# Altium project backplane.PRJPCB
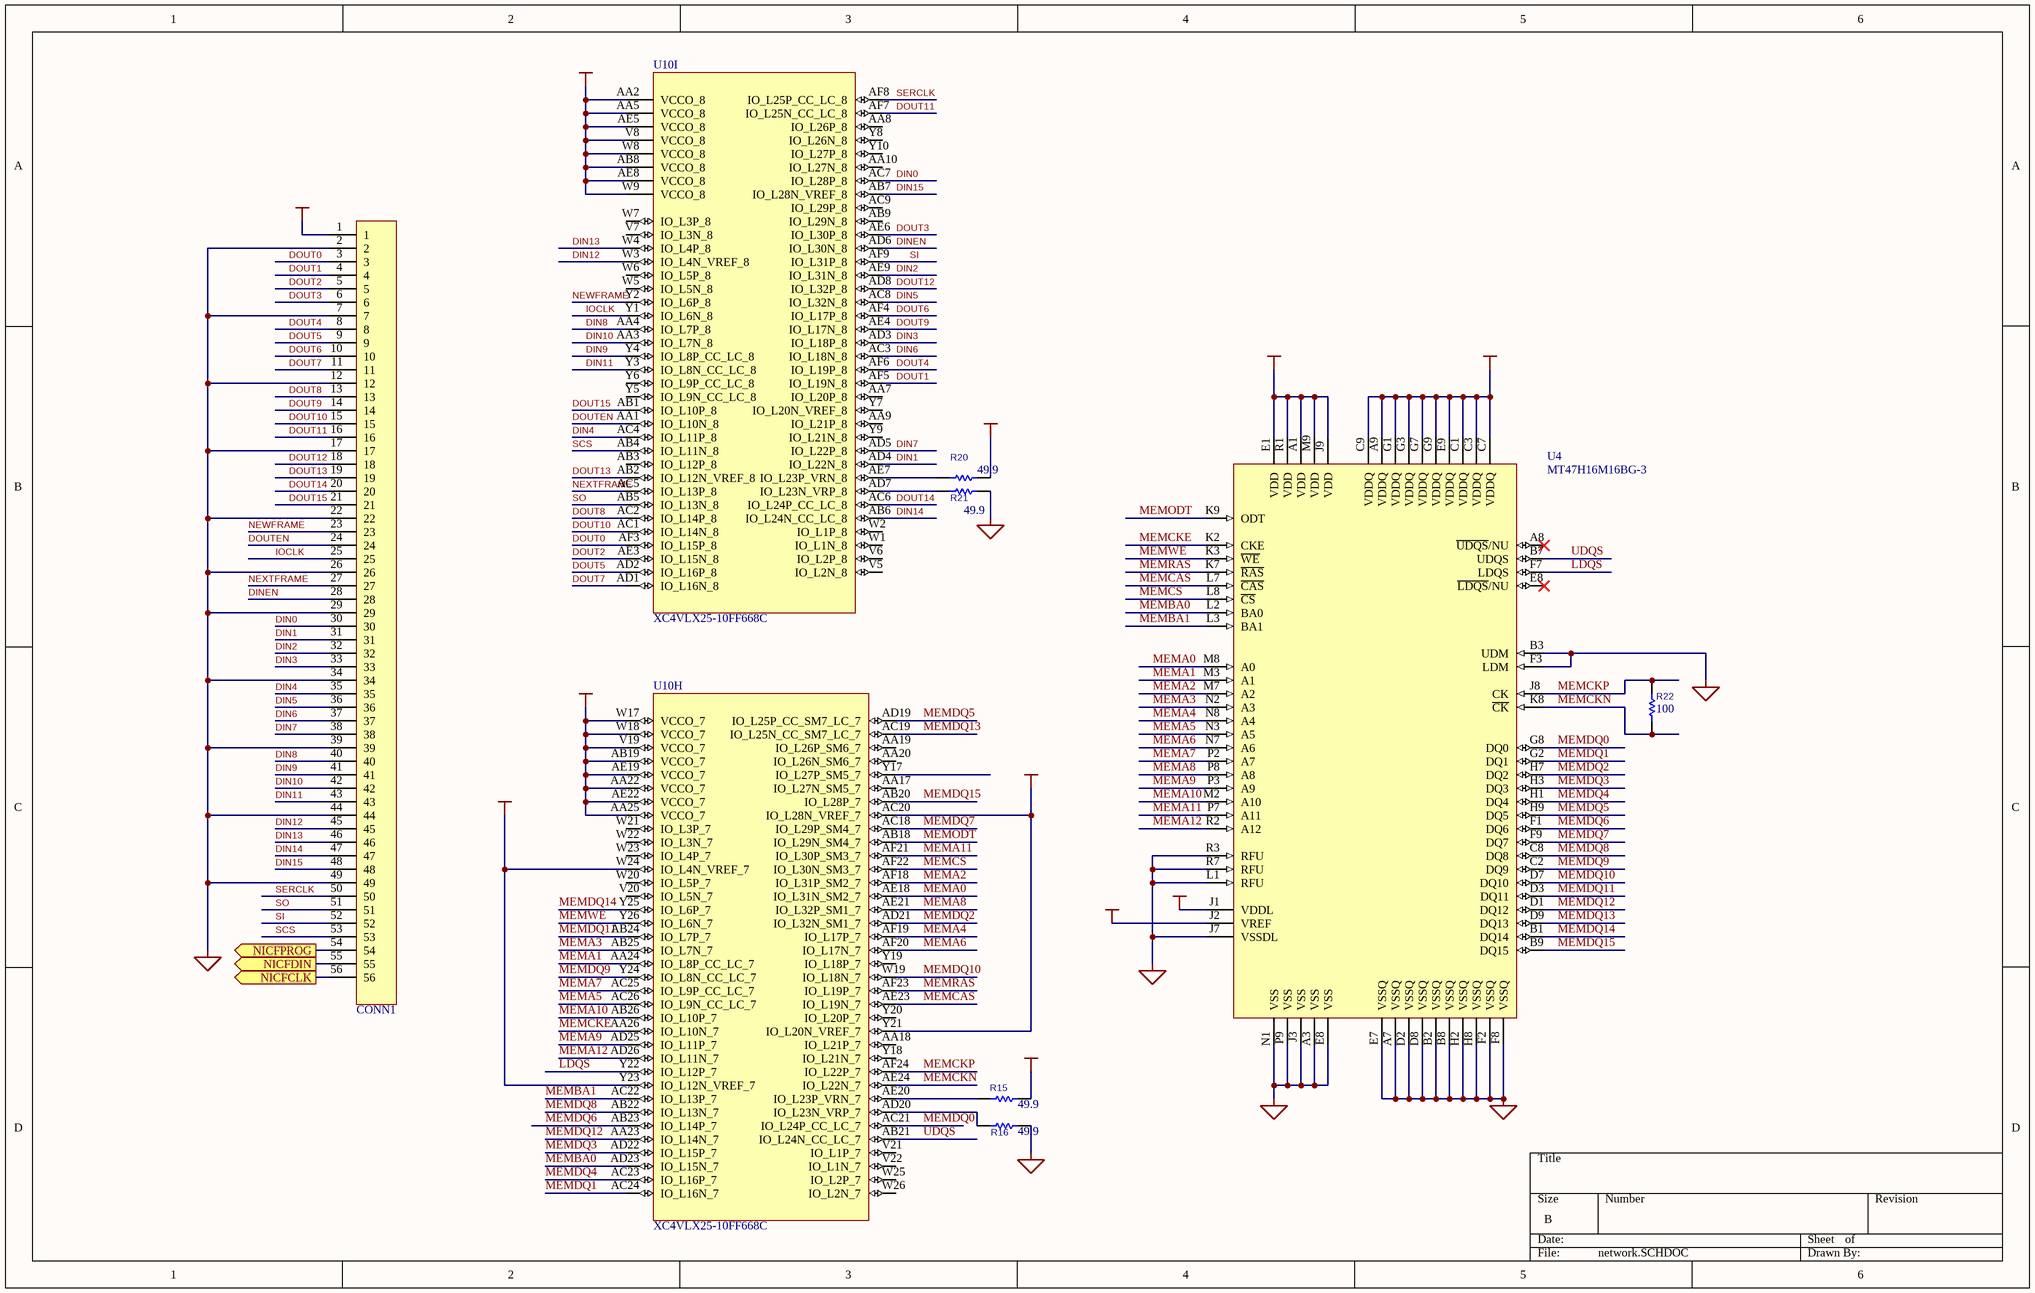
[diagram p0: network.SCHDOC]
8 sheets, 200 parts. Net scope: flat (ports and power ports of the same name join across sheets).
Board file: backplane.PCBDOC
Sheets:
  network.SCHDOC
  peripheralconn.SCHDOC
  DSPCONN.12-15.SCHDOC
  power and clocks.SCHDOC
  DSPCONN.8-11.SCHDOC
  DSPCONN.4-7.SCHDOC
  DSPCONN.0-3.SCHDOC
  fpga.SCHDOC

## Sheet network.SCHDOC
size B

### Parts
CONN1  CON56B  [HDR56]  (value not drawn)
R15  value 49.9  [0402]  (hidden comment: 50)
R16  value 49.9  [0402]  (hidden comment: 50)
R20  value 49.9  [0402]  (hidden comment: 50)
R21  value 49.9  [0402]  (hidden comment: 50)
R22  value 100  [0402]  (hidden comment: 50)
U4  MT47H16M16BG-3  [MICRON84FBGA]
U10  XC4VLX25-10FF668C  [Xilinx FF668]  (parts H,I of 13)

### Ports
NICFCLK (out), NICFDIN (out), NICFPROG (out)

### Nets
3.3VCC: R20.1
+0.9VCC: U4.J2(VREF) U10.AC20(IO_L28N_VREF_7) U10.W24(IO_L4N_VREF_7) U10.Y21(IO_L20N_VREF_7) U10.Y23(IO_L12N_VREF_7)
+1.8VCC: R15.1 U4.A1(VDD) U4.A9(VDDQ) U4.C1(VDDQ) U4.C3(VDDQ) U4.C7(VDDQ) U4.C9(VDDQ) U4.E1(VDD) U4.E9(VDDQ) U4.G1(VDDQ) U4.G3(VDDQ) U4.G7(VDDQ) U4.G9(VDDQ) U4.J1(VDDL) U4.J9(VDD) U4.M9(VDD) U4.R1(VDD) U10.AA22(VCCO_7) U10.AA25(VCCO_7) U10.AB19(VCCO_7) U10.AE19(VCCO_7) U10.AE22(VCCO_7) U10.V19(VCCO_7) U10.W17(VCCO_7) U10.W18(VCCO_7)
GND: CONN1.2 CONN1.7 CONN1.12 CONN1.17 CONN1.22 CONN1.26 CONN1.29 CONN1.34 CONN1.39 CONN1.44 CONN1.49 R16.1 R21.1 U4.A3(VSS) U4.A7(VSSQ) U4.B2(VSSQ) U4.B3(UDM) U4.B8(VSSQ) U4.D2(VSSQ) U4.D8(VSSQ) U4.E7(VSSQ) U4.E8(VSS) U4.F2(VSSQ) U4.F3(LDM) U4.F8(VSSQ) U4.H2(VSSQ) U4.H8(VSSQ) U4.J3(VSS) U4.J7(VSSDL) U4.L1(RFU) U4.N1(VSS) U4.P9(VSS) U4.R3(RFU) U4.R7(RFU)
VCC: CONN1.1 U10.AA2(VCCO_8) U10.AA5(VCCO_8) U10.AB8(VCCO_8) U10.AE5(VCCO_8) U10.AE8(VCCO_8) U10.V8(VCCO_8) U10.W8(VCCO_8) U10.W9(VCCO_8)
DIN0: CONN1.30 U10.AC7(IO_L28P_8)
DIN1: CONN1.31 U10.AD4(IO_L22N_8)
DIN2: CONN1.32 U10.AE9(IO_L31N_8)
DIN3: CONN1.33 U10.AD3(IO_L18P_8)
DIN4: CONN1.35 U10.AC4(IO_L11P_8)
DIN5: CONN1.36 U10.AC8(IO_L32N_8)
DIN6: CONN1.37 U10.AC3(IO_L18N_8)
DIN7: CONN1.38 U10.AD5(IO_L22P_8)
DIN8: CONN1.40 U10.AA4(IO_L7P_8)
DIN9: CONN1.41 U10.Y4(IO_L8P_CC_LC_8)
DIN10: CONN1.42 U10.AA3(IO_L7N_8)
DIN11: CONN1.43 U10.Y3(IO_L8N_CC_LC_8)
DIN12: CONN1.45 U10.W3(IO_L4N_VREF_8)
DIN13: CONN1.46 U10.W4(IO_L4P_8)
DIN14: CONN1.47 U10.AB6(IO_L24N_CC_LC_8)
DIN15: CONN1.48 U10.AB7(IO_L28N_VREF_8)
DINEN: CONN1.28 U10.AD6(IO_L30N_8)
DOUT0: CONN1.3 U10.AF3(IO_L15P_8)
DOUT1: CONN1.4 U10.AF5(IO_L19N_8)
DOUT2: CONN1.5 U10.AE3(IO_L15N_8)
DOUT3: CONN1.6 U10.AE6(IO_L30P_8)
DOUT4: CONN1.8 U10.AF6(IO_L19P_8)
DOUT5: CONN1.9 U10.AD2(IO_L16P_8)
DOUT6: CONN1.10 U10.AF4(IO_L17P_8)
DOUT7: CONN1.11 U10.AD1(IO_L16N_8)
DOUT8: CONN1.13 U10.AC2(IO_L14P_8)
DOUT9: CONN1.14 U10.AE4(IO_L17N_8)
DOUT10: CONN1.15 U10.AC1(IO_L14N_8)
DOUT11: CONN1.16 U10.AF7(IO_L25N_CC_LC_8)
DOUT12: CONN1.18 U10.AD8(IO_L32P_8)
DOUT13: CONN1.19 U10.AB2(IO_L12N_VREF_8)
DOUT14: CONN1.20 U10.AC6(IO_L24P_CC_LC_8)
DOUT15: CONN1.21 U10.AB1(IO_L10P_8)
DOUTEN: CONN1.24 U10.AA1(IO_L10N_8)
IOCLK: CONN1.25 U10.Y1(IO_L6N_8)
LDQS: U4.F7(LDQS) U10.Y22(IO_L12P_7)
MEMA0: U4.M8(A0) U10.AE18(IO_L31N_SM2_7)
MEMA1: U4.M3(A1) U10.AA24(IO_L8P_CC_LC_7)
MEMA2: U4.M7(A2) U10.AF18(IO_L31P_SM2_7)
MEMA3: U4.N2(A3) U10.AB25(IO_L7N_7)
MEMA4: U4.N8(A4) U10.AF19(IO_L17P_7)
MEMA5: U4.N3(A5) U10.AC26(IO_L9N_CC_LC_7)
MEMA6: U4.N7(A6) U10.AF20(IO_L17N_7)
MEMA7: U4.P2(A7) U10.AC25(IO_L9P_CC_LC_7)
MEMA8: U4.P8(A8) U10.AE21(IO_L32P_SM1_7)
MEMA9: U4.P3(A9) U10.AD25(IO_L11P_7)
MEMA10: U4.M2(A10) U10.AB26(IO_L10P_7)
MEMA11: U4.P7(A11) U10.AF21(IO_L30P_SM3_7)
MEMA12: U4.R2(A12) U10.AD26(IO_L11N_7)
MEMBA0: U4.L2(BA0) U10.AD23(IO_L15N_7)
MEMBA1: U4.L3(BA1) U10.AC22(IO_L13P_7)
MEM~{CAS}: U4.L7(~{CAS}) U10.AE23(IO_L19N_7)
MEM~{CS}: U4.L8(~{CS}) U10.AF22(IO_L30N_SM3_7)
MEMCKE: U4.K2(CKE) U10.AA26(IO_L10N_7)
MEMCKN: R22.2 U4.K8(~{CK}) U10.AE24(IO_L22N_7)
MEMCKP: R22.1 U4.J8(CK) U10.AF24(IO_L22P_7)
MEMDQ0: U4.G8(DQ0) U10.AC21(IO_L24P_CC_LC_7)
MEMDQ1: U4.G2(DQ1) U10.AC24(IO_L16N_7)
MEMDQ2: U4.H7(DQ2) U10.AD21(IO_L32N_SM1_7)
MEMDQ3: U4.H3(DQ3) U10.AD22(IO_L15P_7)
MEMDQ4: U4.H1(DQ4) U10.AC23(IO_L16P_7)
MEMDQ5: U4.H9(DQ5) U10.AD19(IO_L25P_CC_SM7_LC_7)
MEMDQ6: U4.F1(DQ6) U10.AB23(IO_L14P_7)
MEMDQ7: U4.F9(DQ7) U10.AC18(IO_L29P_SM4_7)
MEMDQ8: U4.C8(DQ8) U10.AB22(IO_L13N_7)
MEMDQ9: U4.C2(DQ9) U10.Y24(IO_L8N_CC_LC_7)
MEMDQ10: U4.D7(DQ10) U10.W19(IO_L18N_7)
MEMDQ11: U4.D3(DQ11) U10.AB24(IO_L7P_7)
MEMDQ12: U4.D1(DQ12) U10.AA23(IO_L14N_7)
MEMDQ13: U4.D9(DQ13) U10.AC19(IO_L25N_CC_SM7_LC_7)
MEMDQ14: U4.B1(DQ14) U10.Y25(IO_L6P_7)
MEMDQ15: U4.B9(DQ15) U10.AB20(IO_L28P_7)
MEMODT: U4.K9(ODT) U10.AB18(IO_L29N_SM4_7)
MEM~{RAS}: U4.K7(~{RAS}) U10.AF23(IO_L19P_7)
MEM~{WE}: U4.K3(~{WE}) U10.Y26(IO_L6N_7)
NEWFRAME: CONN1.23 U10.Y2(IO_L6P_8)
NEXTFRAME: CONN1.27 U10.AC5(IO_L13P_8)
SCS: CONN1.53 U10.AB4(IO_L11N_8)
SERCLK: CONN1.50 U10.AF8(IO_L25P_CC_LC_8)
SI: CONN1.52 U10.AF9(IO_L31P_8)
SO: CONN1.51 U10.AB5(IO_L13N_8)
UDQS: U4.B7(UDQS) U10.AB21(IO_L24N_CC_LC_7)
NetCONN1_54: CONN1.54 ; port NICFPROG
NetCONN1_55: CONN1.55 ; port NICFDIN
NetCONN1_56: CONN1.56 ; port NICFCLK
NetR15_2: R15.2 U10.AE20(IO_L23P_VRN_7)
NetR16_2: R16.2 U10.AD20(IO_L23N_VRP_7)
NetR20_2: R20.2 U10.AE7(IO_L23P_VRN_8)
NetR21_2: R21.2 U10.AD7(IO_L23N_VRP_8)

Not connected (* = marked no-connect by the designer): U4 A8(~{UDQS}/NU)*; U10 AA7(IO_L20P_8) AA8(IO_L26P_8) AA9(IO_L21P_8) AA10(IO_L27N_8) AA17(IO_L27N_SM5_7) AA18(IO_L21P_7) AA19(IO_L26P_SM6_7) AA20(IO_L26N_SM6_7) AB3(IO_L12P_8) AB9(IO_L29N_8) AC9(IO_L29P_8) V5(IO_L2N_8) V6(IO_L2P_8) V7(IO_L3N_8) V20(IO_L5N_7) V21(IO_L1P_7) V22(IO_L1N_7) W1(IO_L1N_8) W2(IO_L1P_8) W5(IO_L5N_8) W6(IO_L5P_8) W7(IO_L3P_8) W20(IO_L5P_7) W21(IO_L3P_7) W22(IO_L3N_7) W23(IO_L4P_7) W25(IO_L2P_7) W26(IO_L2N_7) Y5(IO_L9N_CC_LC_8) Y6(IO_L9P_CC_LC_8) Y7(IO_L20N_VREF_8) Y8(IO_L26N_8) Y9(IO_L21N_8) Y10(IO_L27P_8) Y17(IO_L27P_SM5_7) Y18(IO_L21N_7) Y19(IO_L18P_7) Y20(IO_L20P_7)

### Library data of the parts
R15 R16 R20-R22 = RESISTOR: Standard Passive Resistor; 50: Value; Tolerance: 1%
U4 = MT47H16M16BG-3: Micron DDR2 SDRAM
U10 = XC4VLX25-10FF668C: Xilinx Virtex-4

## Sheet peripheralconn.SCHDOC: Backplane
size B; Engineer: Eric Jonas; Organization: Wilson Lab; Address1: Picower Institute, MIT; Address2: 43 Vassar St. 46-5227; Address3: Cambridge, MA 02139; Address4: Australia 2086
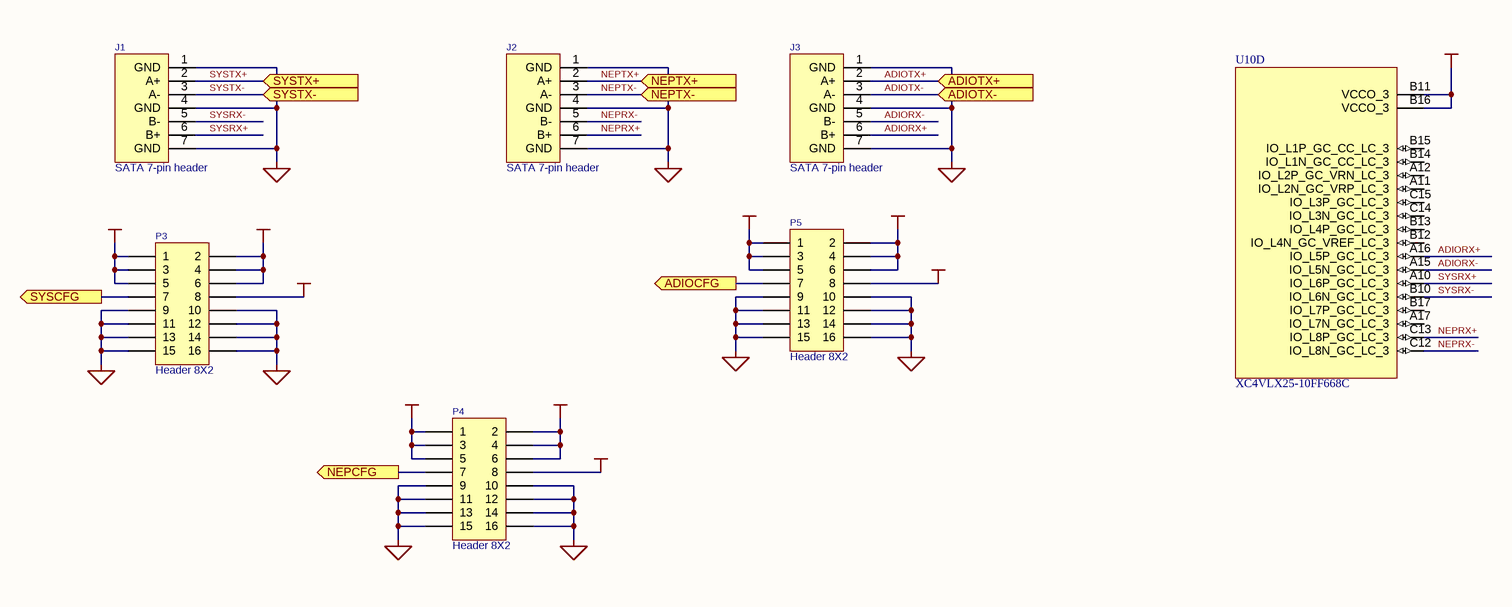
[diagram p1: peripheralconn.SCHDOC]

### Parts
J1  SATA 7-pin header  [MOLES 67800-5005]
J2  SATA 7-pin header  [MOLES 67800-5005]
J3  SATA 7-pin header  [MOLES 67800-5005]
P3  Header 8X2  [MOLEX 15-91-2160]
P4  Header 8X2  [MOLEX 15-91-2160]
P5  Header 8X2  [MOLEX 15-91-2160]
U10  XC4VLX25-10FF668C  [Xilinx FF668]  (part D of 13)

### Ports
ADIOCFG (out), ADIOTX+ (in), ADIOTX- (in), NEPCFG (out), NEPTX+ (in), NEPTX- (in), SYSCFG (out), SYSTX+ (in), SYSTX- (in)

### Nets
+2.5VCC: U10.B11(VCCO_3) U10.B16(VCCO_3)
+5VCC: P3.2 P3.4 P3.6 P4.2 P4.4 P4.6 P5.2 P5.4 P5.6
+12VCC: P3.8 P4.8 P5.8
GND: J1.1(GND) J1.4(GND) J1.7(GND) J2.1(GND) J2.4(GND) J2.7(GND) J3.1(GND) J3.4(GND) J3.7(GND) P3.9 P3.10 P3.11 P3.12 P3.13 P3.14 P3.15 P3.16 P4.9 P4.10 P4.11 P4.12 P4.13 P4.14 P4.15 P4.16 P5.9 P5.10 P5.11 P5.12 P5.13 P5.14 P5.15 P5.16
VCC: P3.1 P3.3 P3.5 P4.1 P4.3 P4.5 P5.1 P5.3 P5.5
ADIORX+: J3.6(B+) U10.A16(IO_L5P_GC_LC_3)
ADIORX-: J3.5(B-) U10.A15(IO_L5N_GC_LC_3)
ADIOTX+: J3.2(A+) ; port ADIOTX+
ADIOTX-: J3.3(A-) ; port ADIOTX-
NEPRX+: J2.6(B+) U10.C13(IO_L8P_GC_LC_3)
NEPRX-: J2.5(B-) U10.C12(IO_L8N_GC_LC_3)
NEPTX+: J2.2(A+) ; port NEPTX+
NEPTX-: J2.3(A-) ; port NEPTX-
SYSRX+: J1.6(B+) U10.A10(IO_L6P_GC_LC_3)
SYSRX-: J1.5(B-) U10.B10(IO_L6N_GC_LC_3)
SYSTX+: J1.2(A+) ; port SYSTX+
SYSTX-: J1.3(A-) ; port SYSTX-
NetP3_7: P3.7 ; port SYSCFG
NetP4_7: P4.7 ; port NEPCFG
NetP5_7: P5.7 ; port ADIOCFG

Not connected (* = marked no-connect by the designer): U10 A11(IO_L2N_GC_VRP_LC_3) A12(IO_L2P_GC_VRN_LC_3) A17(IO_L7N_GC_LC_3) B12(IO_L4N_GC_VREF_LC_3) B13(IO_L4P_GC_LC_3) B14(IO_L1N_GC_CC_LC_3) B15(IO_L1P_GC_CC_LC_3) B17(IO_L7P_GC_LC_3) C14(IO_L3N_GC_LC_3) C15(IO_L3P_GC_LC_3)

### Notes on the sheet
- Title:
- Engineer:
- Date:
- Revision:
- Sheet
- of
- File:

### Library data of the parts
J1-J3 = SATA-7
P3-P5 = Header 8X2: Header, 8-Pin, Dual row; LatestRevisionDate: 17-Jul-2002; LatestRevisionNote: Re-released for DXP Platform.; Publisher: Altium Limited
U10 = XC4VLX25-10FF668C: Xilinx Virtex-4

## Sheet DSPCONN.12-15.SCHDOC: Backplane
size B; Engineer: Eric Jonas; Organization: Wilson Lab; Address1: Picower Institute, MIT; Address2: 43 Vassar St. 46-5227; Address3: Cambridge, MA 02139; Address4: Australia 2086
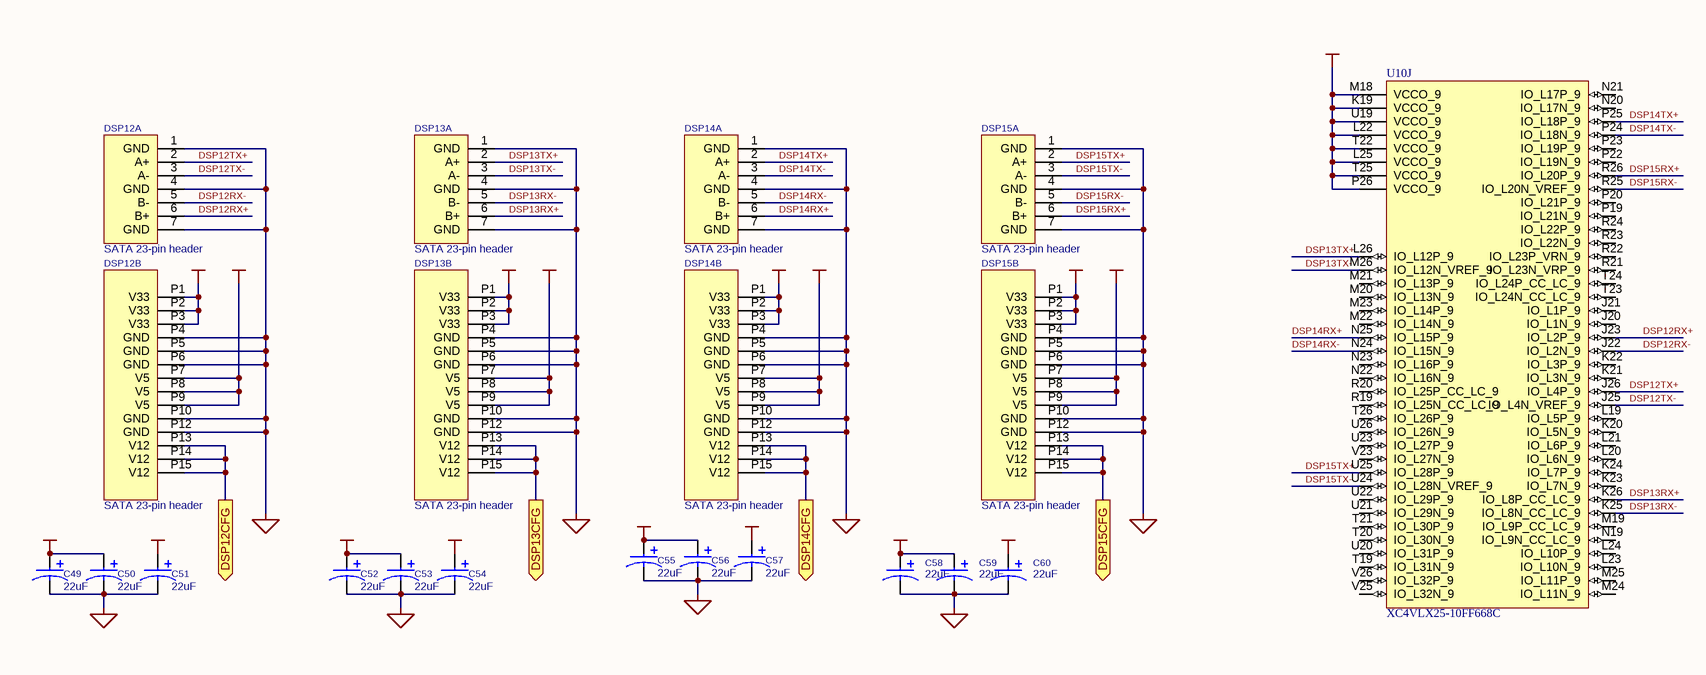
[diagram p2: DSPCONN.12-15.SCHDOC]

### Parts
C49  value 22uF  [6032]  (hidden comment: POLCAP2)
C50  value 22uF  [6032]  (hidden comment: POLCAP2)
C51  value 22uF  [6032]  (hidden comment: POLCAP2)
C52  value 22uF  [6032]  (hidden comment: POLCAP2)
C53  value 22uF  [6032]  (hidden comment: POLCAP2)
C54  value 22uF  [6032]  (hidden comment: POLCAP2)
C55  value 22uF  [6032]  (hidden comment: POLCAP2)
C56  value 22uF  [6032]  (hidden comment: POLCAP2)
C57  value 22uF  [6032]  (hidden comment: POLCAP2)
C58  value 22uF  [6032]  (hidden comment: POLCAP2)
C59  value 22uF  [6032]  (hidden comment: POLCAP2)
C60  value 22uF  [6032]  (hidden comment: POLCAP2)
DSP12  SATA 23-pin header  [MOLEX 87713-1001]  (parts A,B of 2)
DSP13  SATA 23-pin header  [MOLEX 87713-1001]  (parts A,B of 2)
DSP14  SATA 23-pin header  [MOLEX 87713-1001]  (parts A,B of 2)
DSP15  SATA 23-pin header  [MOLEX 87713-1001]  (parts A,B of 2)
U10  XC4VLX25-10FF668C  [Xilinx FF668]  (part J of 13)

### Ports
DSP12CFG (out), DSP13CFG (out), DSP14CFG (out), DSP15CFG (out)

### Nets
+2.5VCC: U10.K19(VCCO_9) U10.L22(VCCO_9) U10.L25(VCCO_9) U10.M18(VCCO_9) U10.P26(VCCO_9) U10.T22(VCCO_9) U10.T25(VCCO_9) U10.U19(VCCO_9)
+5VCC: C51.1 C54.1 C57.1 C60.1 DSP12.P7(V5) DSP12.P8(V5) DSP12.P9(V5) DSP13.P7(V5) DSP13.P8(V5) DSP13.P9(V5) DSP14.P7(V5) DSP14.P8(V5) DSP14.P9(V5) DSP15.P7(V5) DSP15.P8(V5) DSP15.P9(V5)
GND: C49.2 C50.2 C51.2 C52.2 C53.2 C54.2 C55.2 C56.2 C57.2 C58.2 C59.2 C60.2 DSP12.1(GND) DSP12.4(GND) DSP12.7(GND) DSP12.P4(GND) DSP12.P5(GND) DSP12.P6(GND) DSP12.P10(GND) DSP12.P12(GND) DSP13.1(GND) DSP13.4(GND) DSP13.7(GND) DSP13.P4(GND) DSP13.P5(GND) DSP13.P6(GND) DSP13.P10(GND) DSP13.P12(GND) DSP14.1(GND) DSP14.4(GND) DSP14.7(GND) DSP14.P4(GND) DSP14.P5(GND) DSP14.P6(GND) DSP14.P10(GND) DSP14.P12(GND) DSP15.1(GND) DSP15.4(GND) DSP15.7(GND) DSP15.P4(GND) DSP15.P5(GND) DSP15.P6(GND) DSP15.P10(GND) DSP15.P12(GND)
VCC2: C49.1 C50.1 C52.1 C53.1 C55.1 C56.1 C58.1 C59.1 DSP12.P1(V33) DSP12.P2(V33) DSP12.P3(V33) DSP13.P1(V33) DSP13.P2(V33) DSP13.P3(V33) DSP14.P1(V33) DSP14.P2(V33) DSP14.P3(V33) DSP15.P1(V33) DSP15.P2(V33) DSP15.P3(V33)
DSP12RX+: DSP12.6(B+) U10.J23(IO_L2P_9)
DSP12RX-: DSP12.5(B-) U10.J22(IO_L2N_9)
DSP12TX+: DSP12.2(A+) U10.J26(IO_L4P_9)
DSP12TX-: DSP12.3(A-) U10.J25(IO_L4N_VREF_9)
DSP13RX+: DSP13.6(B+) U10.K26(IO_L8P_CC_LC_9)
DSP13RX-: DSP13.5(B-) U10.K25(IO_L8N_CC_LC_9)
DSP13TX+: DSP13.2(A+) U10.L26(IO_L12P_9)
DSP13TX-: DSP13.3(A-) U10.M26(IO_L12N_VREF_9)
DSP14RX+: DSP14.6(B+) U10.N25(IO_L15P_9)
DSP14RX-: DSP14.5(B-) U10.N24(IO_L15N_9)
DSP14TX+: DSP14.2(A+) U10.P25(IO_L18P_9)
DSP14TX-: DSP14.3(A-) U10.P24(IO_L18N_9)
DSP15RX+: DSP15.6(B+) U10.R26(IO_L20P_9)
DSP15RX-: DSP15.5(B-) U10.R25(IO_L20N_VREF_9)
DSP15TX+: DSP15.2(A+) U10.U25(IO_L28P_9)
DSP15TX-: DSP15.3(A-) U10.U24(IO_L28N_VREF_9)
NetDSP12_P13: DSP12.P13(V12) DSP12.P14(V12) DSP12.P15(V12) ; port DSP12CFG
NetDSP13_P13: DSP13.P13(V12) DSP13.P14(V12) DSP13.P15(V12) ; port DSP13CFG
NetDSP14_P13: DSP14.P13(V12) DSP14.P14(V12) DSP14.P15(V12) ; port DSP14CFG
NetDSP15_P13: DSP15.P13(V12) DSP15.P14(V12) DSP15.P15(V12) ; port DSP15CFG

Not connected (* = marked no-connect by the designer): U10 J20(IO_L1N_9) J21(IO_L1P_9) K20(IO_L5N_9) K21(IO_L3N_9) K22(IO_L3P_9) K23(IO_L7N_9) K24(IO_L7P_9) L19(IO_L5P_9) L20(IO_L6N_9) L21(IO_L6P_9) L23(IO_L10N_9) L24(IO_L10P_9) M19(IO_L9P_CC_LC_9) M20(IO_L13N_9) M21(IO_L13P_9) M22(IO_L14N_9) M23(IO_L14P_9) M24(IO_L11N_9) M25(IO_L11P_9) N19(IO_L9N_CC_LC_9) N20(IO_L17N_9) N21(IO_L17P_9) N22(IO_L16N_9) N23(IO_L16P_9) P19(IO_L21N_9) P20(IO_L21P_9) P22(IO_L19N_9) P23(IO_L19P_9) R19(IO_L25N_CC_LC_9) R20(IO_L25P_CC_LC_9) R21(IO_L23N_VRP_9) R22(IO_L23P_VRN_9) R23(IO_L22N_9) R24(IO_L22P_9) T19(IO_L31N_9) T20(IO_L30N_9) T21(IO_L30P_9) T23(IO_L24N_CC_LC_9) T24(IO_L24P_CC_LC_9) T26(IO_L26P_9) U20(IO_L31P_9) U21(IO_L29N_9) U22(IO_L29P_9) U23(IO_L27P_9) U26(IO_L26N_9) V23(IO_L27N_9) V25(IO_L32N_9) V26(IO_L32P_9)

### Notes on the sheet
- Title:
- Engineer:
- Date:
- Revision:
- Sheet
- of
- File:

### Library data of the parts
C49-C60 = POLCAP2: Standard Capacitor
DSP12-DSP15 = SATA-23
U10 = XC4VLX25-10FF668C: Xilinx Virtex-4

## Sheet power and clocks.SCHDOC: Backplane
size B; Engineer: Eric Jonas; Organization: Wilson Lab; Address1: Picower Institute, MIT; Address2: 43 Vassar St. 46-5227; Address3: Cambridge, MA 02139; Address4: Australia 2086
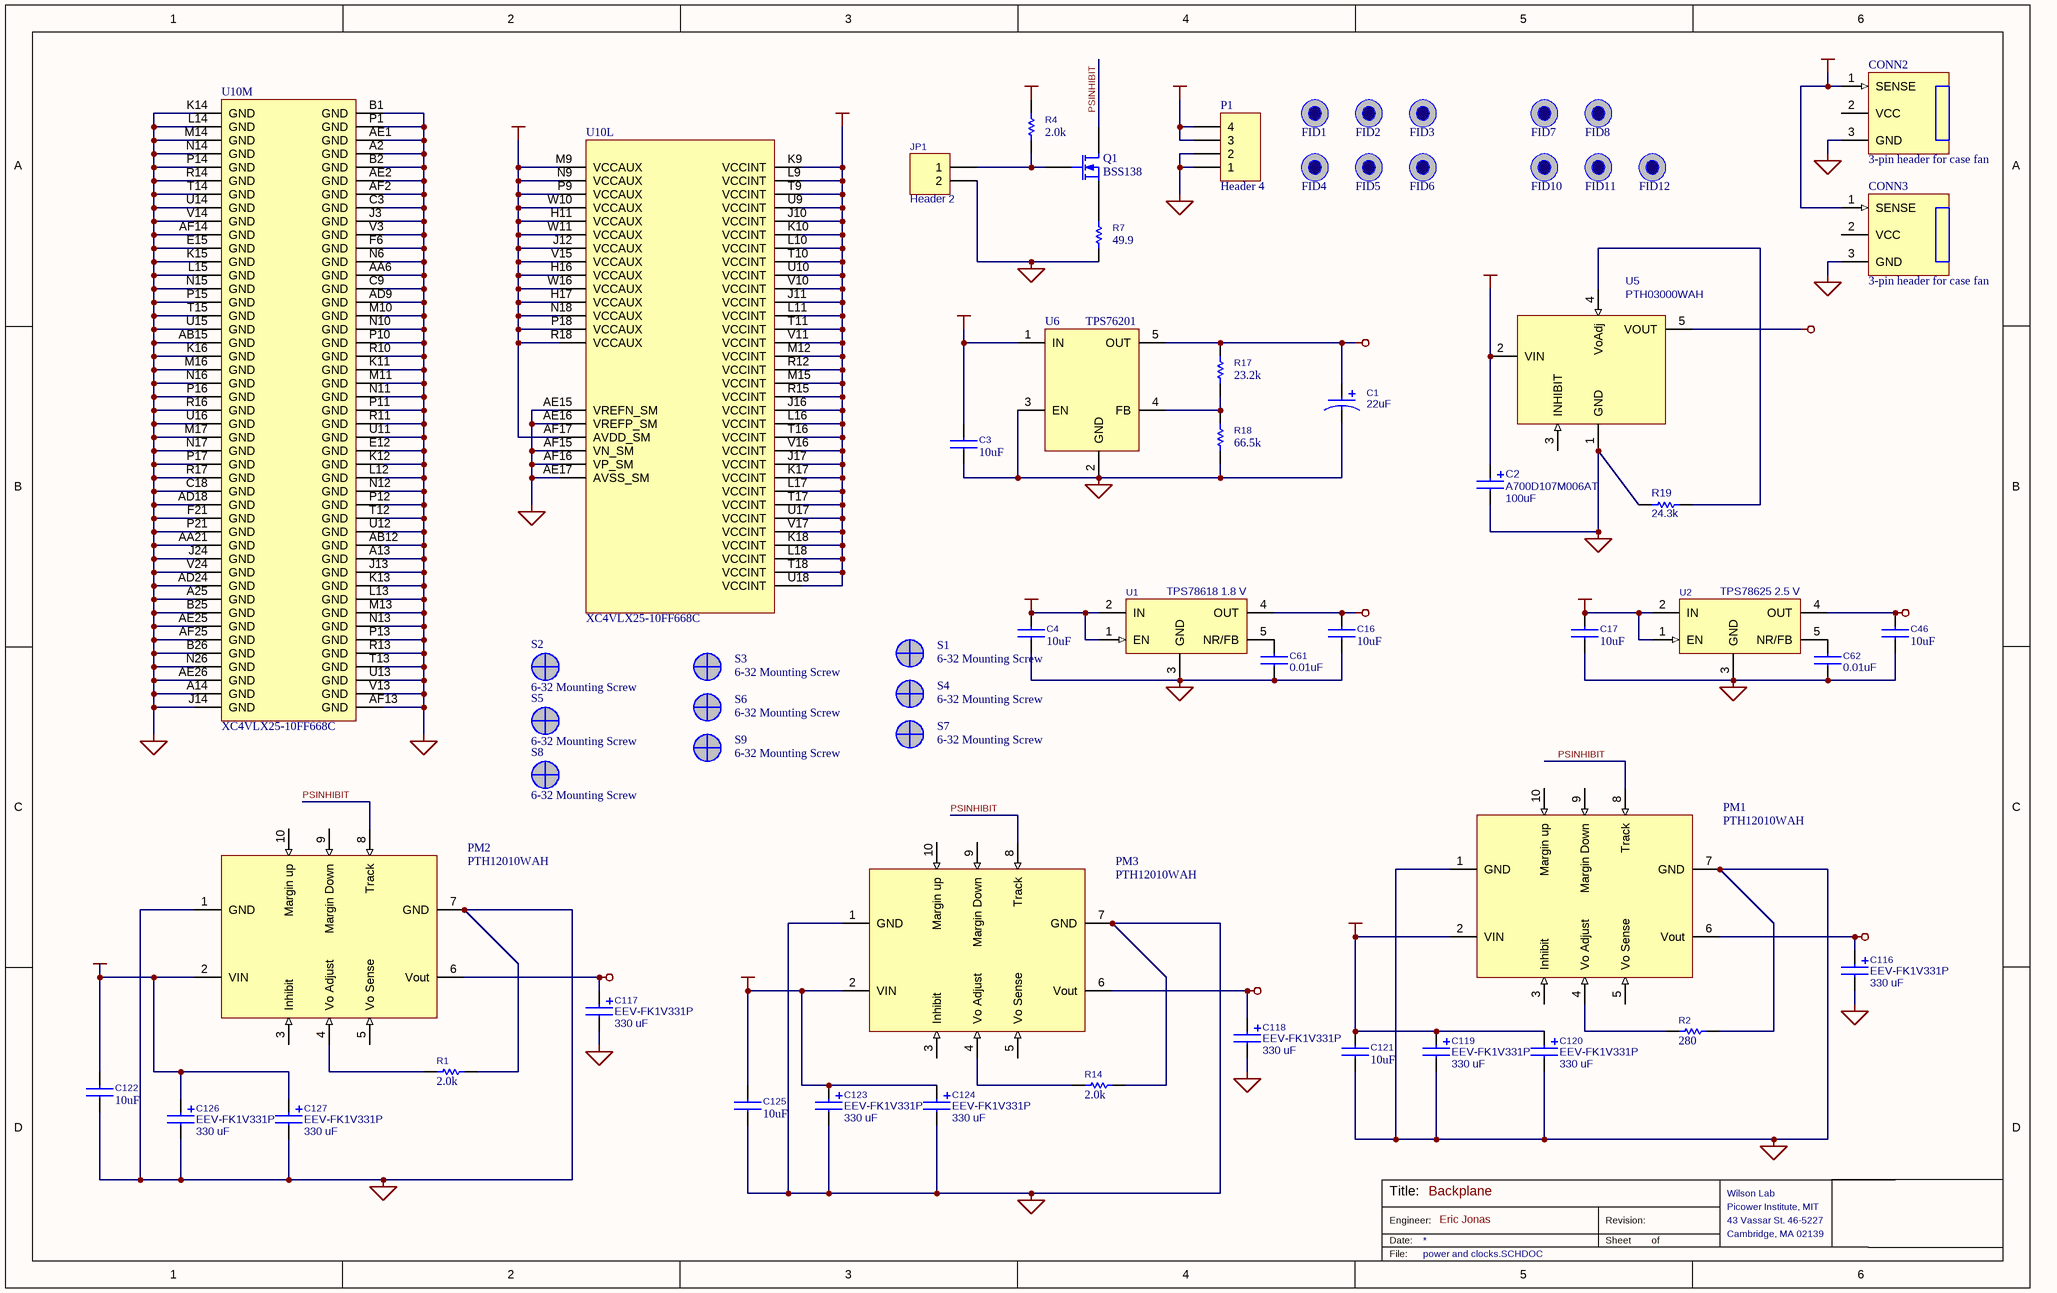
[diagram p3: power and clocks.SCHDOC]

### Parts
C1  value 22uF  [6032]  (hidden comment: POLCAP2)
C2  A700D107M006AT  value 100uF  [7343]
C3  10uF  [1206]
C4  10uF  [1206]
C16  10uF  [1206]
C17  10uF  [1206]
C46  10uF  [1206]
C61  value 0.01uF  [0402]  (hidden comment: CAPACITOR)
C62  value 0.01uF  [0402]  (hidden comment: CAPACITOR)
C116  EEV-FK1V331P  value 330 uF  [PanasonicG]
C117  EEV-FK1V331P  value 330 uF  [PanasonicG]
C118  EEV-FK1V331P  value 330 uF  [PanasonicG]
C119  EEV-FK1V331P  value 330 uF  [PanasonicG]
C120  EEV-FK1V331P  value 330 uF  [PanasonicG]
C121  10uF  [1206]
C122  10uF  [1206]
C123  EEV-FK1V331P  value 330 uF  [PanasonicG]
C124  EEV-FK1V331P  value 330 uF  [PanasonicG]
C125  10uF  [1206]
C126  EEV-FK1V331P  value 330 uF  [PanasonicG]
C127  EEV-FK1V331P  value 330 uF  [PanasonicG]
CONN2  3-pin header for case fan  [CASEFANHDR]
CONN3  3-pin header for case fan  [CASEFANHDR]
FID1  FIDUCIAL  [FIDUCIAL]  (value not drawn)
FID2  FIDUCIAL  [FIDUCIAL]  (value not drawn)
FID3  FIDUCIAL  [FIDUCIAL]  (value not drawn)
FID4  FIDUCIAL  [FIDUCIAL]  (value not drawn)
FID5  FIDUCIAL  [FIDUCIAL]  (value not drawn)
FID6  FIDUCIAL  [FIDUCIAL]  (value not drawn)
FID7  FIDUCIAL  [FIDUCIAL]  (value not drawn)
FID8  FIDUCIAL  [FIDUCIAL]  (value not drawn)
FID10  FIDUCIAL  [FIDUCIAL]  (value not drawn)
FID11  FIDUCIAL  [FIDUCIAL]  (value not drawn)
FID12  FIDUCIAL  [FIDUCIAL]  (value not drawn)
JP1  Header 2  [HDR1X2]
P1  Header 4  [MOLEX 39-29-9042]
PM1  PTH12010WAH  [PTH12010WAH]
PM2  PTH12010WAH  [PTH12010WAH]
PM3  PTH12010WAH  [PTH12010WAH]
Q1  BSS138  [SO-G3/D4.1]
R1  2.0k  [1206]
R2  280  [1206]
R4  value 2.0k  [1206]  (hidden comment: 5k)
R7  value 49.9  [1206]  (hidden comment: 50)
R14  2.0k  [1206]
R17  23.2k  [1206]
R18  66.5k  [1206]
R19  value 24.3k  [1206]  (hidden comment: RESISTOR)
S1  6-32 Mounting Screw  [SCREW6-32]
S2  6-32 Mounting Screw  [SCREW6-32]
S3  6-32 Mounting Screw  [SCREW6-32]
S4  6-32 Mounting Screw  [SCREW6-32]
S5  6-32 Mounting Screw  [SCREW6-32]
S6  6-32 Mounting Screw  [SCREW6-32]
S7  6-32 Mounting Screw  [SCREW6-32]
S8  6-32 Mounting Screw  [SCREW6-32]
S9  6-32 Mounting Screw  [SCREW6-32]
U1  TPS78618 1.8 V  [KTT]
U2  TPS78625 2.5 V  [KTT]
U5  PTH03000WAH  [TI EUS]
U6  TPS76201  [SO-G5/X.5]
U10  XC4VLX25-10FF668C  [Xilinx FF668]  (parts L,M of 13)

### Nets
+0.9VCC: C1.1 R17.1 U6.5(OUT)
+1.2VCC: U5.5(VOUT) U10.J10(VCCINT) U10.J11(VCCINT) U10.J16(VCCINT) U10.J17(VCCINT) U10.K9(VCCINT) U10.K10(VCCINT) U10.K17(VCCINT) U10.K18(VCCINT) U10.L9(VCCINT) U10.L10(VCCINT) U10.L11(VCCINT) U10.L16(VCCINT) U10.L17(VCCINT) U10.L18(VCCINT) U10.M12(VCCINT) U10.M15(VCCINT) U10.R12(VCCINT) U10.R15(VCCINT) U10.T9(VCCINT) U10.T10(VCCINT) U10.T11(VCCINT) U10.T16(VCCINT) U10.T17(VCCINT) U10.T18(VCCINT) U10.U9(VCCINT) U10.U10(VCCINT) U10.U17(VCCINT) U10.U18(VCCINT) U10.V10(VCCINT) U10.V11(VCCINT) U10.V16(VCCINT) U10.V17(VCCINT)
+1.8VCC: C16.2 U1.4(OUT)
+2.5VCC: C46.2 U2.4(OUT) U10.AF17(AVDD_SM) U10.H11(VCCAUX) U10.H16(VCCAUX) U10.H17(VCCAUX) U10.J12(VCCAUX) U10.M9(VCCAUX) U10.N9(VCCAUX) U10.N18(VCCAUX) U10.P9(VCCAUX) U10.P18(VCCAUX) U10.R18(VCCAUX) U10.V15(VCCAUX) U10.W10(VCCAUX) U10.W11(VCCAUX) U10.W16(VCCAUX)
+5VCC: C116.1 PM1.6(Vout)
+12VCC: C119.1 C120.1 C121.2 C122.2 C123.1 C124.1 C125.2 C126.1 C127.1 CONN2.1(SENSE) CONN3.1(SENSE) P1.3 P1.4 PM1.2(VIN) PM2.2(VIN) PM3.2(VIN)
GND: C1.2 C2.2 C3.1 C4.1 C16.1 C17.1 C46.1 C61.2 C62.2 C116.2 C117.2 C118.2 C119.2 C120.2 C121.1 C122.1 C123.2 C124.2 C125.1 C126.2 C127.2 CONN2.3(GND) CONN3.3(GND) JP1.2 P1.1 P1.2 PM1.1(GND) PM1.7(GND) PM2.1(GND) PM2.7(GND) PM3.1(GND) PM3.7(GND) R1.1 R2.1 R7.2 R14.1 R18.2 R19.2 U1.3(GND) U2.3(GND) U5.1(GND) U6.2(GND) U6.3(EN) U10.A2(GND) U10.A13(GND) U10.A14(GND) U10.A25(GND) U10.AA6(GND) U10.AA21(GND) U10.AB12(GND) U10.AB15(GND) U10.AD9(GND) U10.AD18(GND) U10.AD24(GND) U10.AE1(GND) U10.AE2(GND) U10.AE15(VREFN_SM) U10.AE16(VREFP_SM) U10.AE17(AVSS_SM) U10.AE25(GND) U10.AE26(GND) U10.AF2(GND) U10.AF13(GND) U10.AF14(GND) U10.AF15(VN_SM) U10.AF16(VP_SM) U10.AF25(GND) U10.B1(GND) U10.B2(GND) U10.B25(GND) U10.B26(GND) U10.C3(GND) U10.C9(GND) U10.C18(GND) U10.E12(GND) U10.E15(GND) U10.F6(GND) U10.F21(GND) U10.J3(GND) U10.J13(GND) U10.J14(GND) U10.J24(GND) U10.K11(GND) U10.K12(GND) U10.K13(GND) U10.K14(GND) U10.K15(GND) U10.K16(GND) U10.L12(GND) U10.L13(GND) U10.L14(GND) U10.L15(GND) U10.M10(GND) U10.M11(GND) U10.M13(GND) U10.M14(GND) U10.M16(GND) U10.M17(GND) U10.N6(GND) U10.N10(GND) U10.N11(GND) U10.N12(GND) U10.N13(GND) U10.N14(GND) U10.N15(GND) U10.N16(GND) U10.N17(GND) U10.N26(GND) U10.P1(GND) U10.P10(GND) U10.P11(GND) U10.P12(GND) U10.P13(GND) U10.P14(GND) U10.P15(GND) U10.P16(GND) U10.P17(GND) U10.P21(GND) U10.R10(GND) U10.R11(GND) U10.R13(GND) U10.R14(GND) U10.R16(GND) U10.R17(GND) U10.T12(GND) U10.T13(GND) U10.T14(GND) U10.T15(GND) U10.U11(GND) U10.U12(GND) U10.U13(GND) U10.U14(GND) U10.U15(GND) U10.U16(GND) U10.V3(GND) U10.V13(GND) U10.V14(GND) U10.V24(GND)
VCC: C2.1 C3.2 C4.2 C17.2 C117.1 PM2.6(Vout) R4.1 U1.1(EN) U1.2(IN) U2.1(EN) U2.2(IN) U5.2(VIN) U6.1(IN)
VCC2: C118.1 PM3.6(Vout)
PSINHIBIT: PM1.8(Track) PM2.8(Track) PM3.8(Track) Q1.1(D)
NetC61_1: C61.1 U1.5(NR/FB)
NetC62_1: C62.1 U2.5(NR/FB)
NetJP1_1: JP1.1 Q1.2(G) R4.2
NetPM1_4: PM1.4(Vo_Adjust) R2.2
NetPM2_4: PM2.4(Vo_Adjust) R1.2
NetPM3_4: PM3.4(Vo_Adjust) R14.2
NetQ1_3: Q1.3(S) R7.1
NetR17_2: R17.2 R18.1 U6.4(FB)
NetR19_1: R19.1 U5.4(VoAdj)

Not connected (* = marked no-connect by the designer): CONN2 2(VCC); CONN3 2(VCC); PM1 3(Inhibit) 5(Vo_Sense) 9(Margin_Down) 10(Margin_up); PM2 3(Inhibit) 5(Vo_Sense) 9(Margin_Down) 10(Margin_up); PM3 3(Inhibit) 5(Vo_Sense) 9(Margin_Down) 10(Margin_up); U5 3(INHIBIT)

### Notes on the sheet
- Title:
- Engineer:
- Date:
- Revision:
- Sheet
- of
- File:

### Library data of the parts
C1 = POLCAP2: Standard Capacitor
C2 C116-C120 C123 C124 C126 C127 = POLCAP: Standard Capacitor
C3 C4 C16 C17 C46 C61 C62 C121 C122 C125 = CAPACITOR: Standard Capacitor
  C3 C4 C16 C17 C46 C121 C122 C125: Value: 10uF
CONN2 CONN3 = PCFANHEADER
JP1 = Header 2: Header, 2-Pin; Manufacturer: Generic Components; Class I: Connector; Revision: July-2002: Re-released for DXP Platform.; Publisher: Altium Limited
P1 = Header 4: Header, 4-Pin; LatestRevisionDate: 17-Jul-2002; LatestRevisionNote: Re-released for DXP Platform.; Publisher: Altium Limited
PM1-PM3 = PTH12010W: 12A 12V Input Non-isolated wide-output adj
R1 R2 R4 R7 R14 R17-R19 = RESISTOR: Standard Passive Resistor; Tolerance: 1%
  R1 R14: Value: 2.0k
  R2: Value: 280
  R17: Value: 23.2k
  R18: Value: 66.5k
S1-S9 = MNTSCREW
U1 = TPS768XX: TI 1.5A LDO
U2 = TPS786XX: TI 1.5A LDO
U5 = PTH03000
U6 = TSP76201: TI 100mA LDO
U10 = XC4VLX25-10FF668C: Xilinx Virtex-4

## Sheet DSPCONN.8-11.SCHDOC: Backplane
size B; Engineer: Eric Jonas; Organization: Wilson Lab; Address1: Picower Institute, MIT; Address2: 43 Vassar St. 46-5227; Address3: Cambridge, MA 02139; Address4: Australia 2086
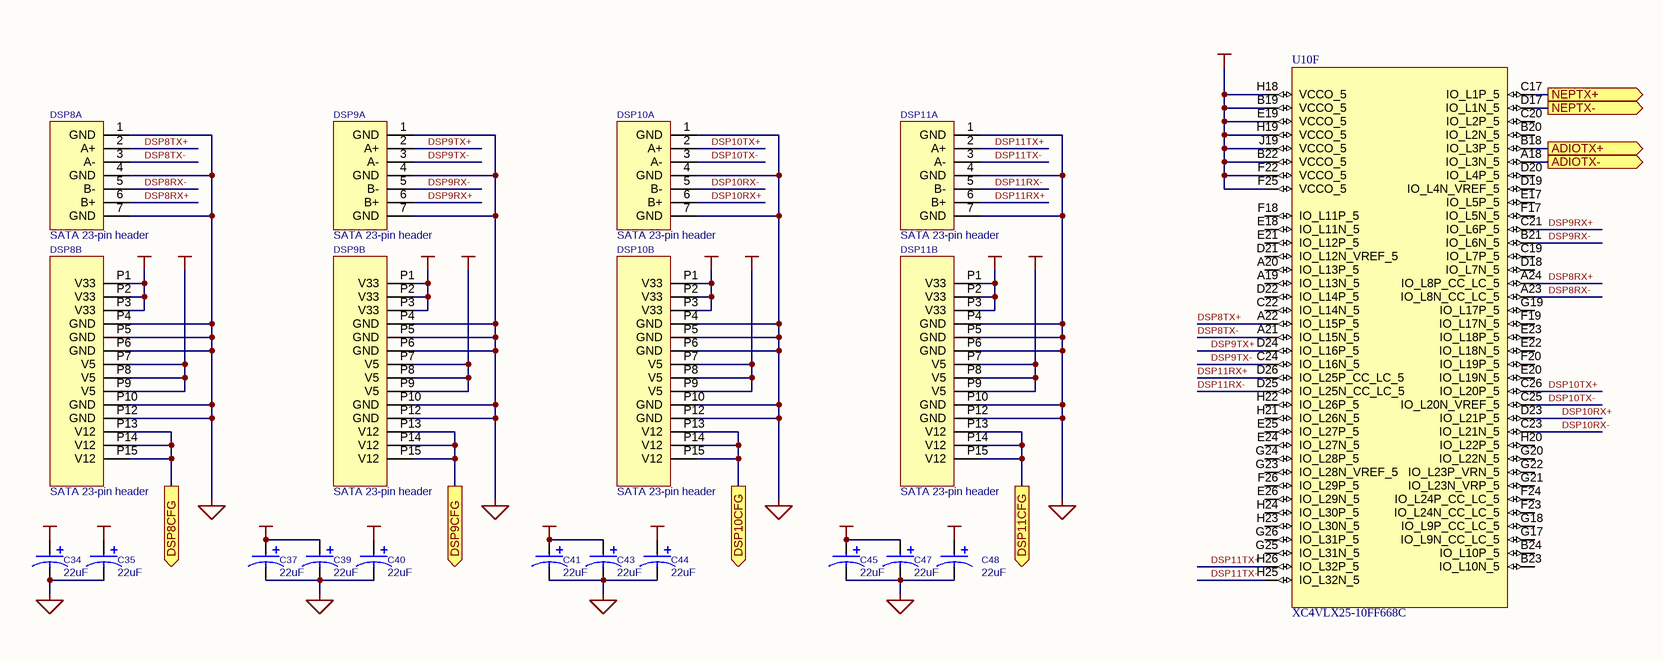
[diagram p4: DSPCONN.8-11.SCHDOC]

### Parts
C34  value 22uF  [6032]  (hidden comment: POLCAP2)
C35  value 22uF  [6032]  (hidden comment: POLCAP2)
C37  value 22uF  [6032]  (hidden comment: POLCAP2)
C39  value 22uF  [6032]  (hidden comment: POLCAP2)
C40  value 22uF  [6032]  (hidden comment: POLCAP2)
C41  value 22uF  [6032]  (hidden comment: POLCAP2)
C43  value 22uF  [6032]  (hidden comment: POLCAP2)
C44  value 22uF  [6032]  (hidden comment: POLCAP2)
C45  value 22uF  [6032]  (hidden comment: POLCAP2)
C47  value 22uF  [6032]  (hidden comment: POLCAP2)
C48  value 22uF  [6032]  (hidden comment: POLCAP2)
DSP8  SATA 23-pin header  [MOLEX 87713-1001]  (parts A,B of 2)
DSP9  SATA 23-pin header  [MOLEX 87713-1001]  (parts A,B of 2)
DSP10  SATA 23-pin header  [MOLEX 87713-1001]  (parts A,B of 2)
DSP11  SATA 23-pin header  [MOLEX 87713-1001]  (parts A,B of 2)
U10  XC4VLX25-10FF668C  [Xilinx FF668]  (part F of 13)

### Ports
ADIOTX+ (out), ADIOTX- (out), DSP8CFG (out), DSP9CFG (out), DSP10CFG (out), DSP11CFG (out), NEPTX+ (out), NEPTX- (out)

### Nets
+2.5VCC: U10.B19(VCCO_5) U10.B22(VCCO_5) U10.E19(VCCO_5) U10.F22(VCCO_5) U10.F25(VCCO_5) U10.H18(VCCO_5) U10.H19(VCCO_5) U10.J19(VCCO_5)
+5VCC: C35.1 C40.1 C44.1 C48.1 DSP8.P7(V5) DSP8.P8(V5) DSP8.P9(V5) DSP9.P7(V5) DSP9.P8(V5) DSP9.P9(V5) DSP10.P7(V5) DSP10.P8(V5) DSP10.P9(V5) DSP11.P7(V5) DSP11.P8(V5) DSP11.P9(V5)
GND: C34.2 C35.2 C37.2 C39.2 C40.2 C41.2 C43.2 C44.2 C45.2 C47.2 C48.2 DSP8.1(GND) DSP8.4(GND) DSP8.7(GND) DSP8.P4(GND) DSP8.P5(GND) DSP8.P6(GND) DSP8.P10(GND) DSP8.P12(GND) DSP9.1(GND) DSP9.4(GND) DSP9.7(GND) DSP9.P4(GND) DSP9.P5(GND) DSP9.P6(GND) DSP9.P10(GND) DSP9.P12(GND) DSP10.1(GND) DSP10.4(GND) DSP10.7(GND) DSP10.P4(GND) DSP10.P5(GND) DSP10.P6(GND) DSP10.P10(GND) DSP10.P12(GND) DSP11.1(GND) DSP11.4(GND) DSP11.7(GND) DSP11.P4(GND) DSP11.P5(GND) DSP11.P6(GND) DSP11.P10(GND) DSP11.P12(GND)
VCC2: C34.1 C37.1 C39.1 C41.1 C43.1 C45.1 C47.1 DSP8.P1(V33) DSP8.P2(V33) DSP8.P3(V33) DSP9.P1(V33) DSP9.P2(V33) DSP9.P3(V33) DSP10.P1(V33) DSP10.P2(V33) DSP10.P3(V33) DSP11.P1(V33) DSP11.P2(V33) DSP11.P3(V33)
ADIOTX+: U10.B18(IO_L3P_5) ; port ADIOTX+
ADIOTX-: U10.A18(IO_L3N_5) ; port ADIOTX-
DSP8RX+: DSP8.6(B+) U10.A24(IO_L8P_CC_LC_5)
DSP8RX-: DSP8.5(B-) U10.A23(IO_L8N_CC_LC_5)
DSP8TX+: DSP8.2(A+) U10.A22(IO_L15P_5)
DSP8TX-: DSP8.3(A-) U10.A21(IO_L15N_5)
DSP9RX+: DSP9.6(B+) U10.C21(IO_L6P_5)
DSP9RX-: DSP9.5(B-) U10.B21(IO_L6N_5)
DSP9TX+: DSP9.2(A+) U10.D24(IO_L16P_5)
DSP9TX-: DSP9.3(A-) U10.C24(IO_L16N_5)
DSP10RX+: DSP10.6(B+) U10.D23(IO_L21P_5)
DSP10RX-: DSP10.5(B-) U10.C23(IO_L21N_5)
DSP10TX+: DSP10.2(A+) U10.C26(IO_L20P_5)
DSP10TX-: DSP10.3(A-) U10.C25(IO_L20N_VREF_5)
DSP11RX+: DSP11.6(B+) U10.D26(IO_L25P_CC_LC_5)
DSP11RX-: DSP11.5(B-) U10.D25(IO_L25N_CC_LC_5)
DSP11TX+: DSP11.2(A+) U10.H26(IO_L32P_5)
DSP11TX-: DSP11.3(A-) U10.H25(IO_L32N_5)
NEPTX+: U10.C17(IO_L1P_5) ; port NEPTX+
NEPTX-: U10.D17(IO_L1N_5) ; port NEPTX-
NetDSP8_P13: DSP8.P13(V12) DSP8.P14(V12) DSP8.P15(V12) ; port DSP8CFG
NetDSP9_P13: DSP9.P13(V12) DSP9.P14(V12) DSP9.P15(V12) ; port DSP9CFG
NetDSP10_P13: DSP10.P13(V12) DSP10.P14(V12) DSP10.P15(V12) ; port DSP10CFG
NetDSP11_P13: DSP11.P13(V12) DSP11.P14(V12) DSP11.P15(V12) ; port DSP11CFG

Not connected (* = marked no-connect by the designer): U10 A19(IO_L13N_5) A20(IO_L13P_5) B20(IO_L2N_5) B23(IO_L10N_5) B24(IO_L10P_5) C19(IO_L7P_5) C20(IO_L2P_5) C22(IO_L14N_5) D18(IO_L7N_5) D19(IO_L4N_VREF_5) D20(IO_L4P_5) D21(IO_L12N_VREF_5) D22(IO_L14P_5) E17(IO_L5P_5) E18(IO_L11N_5) E20(IO_L19N_5) E21(IO_L12P_5) E22(IO_L18N_5) E23(IO_L18P_5) E24(IO_L27N_5) E25(IO_L27P_5) E26(IO_L29N_5) F17(IO_L5N_5) F18(IO_L11P_5) F19(IO_L17N_5) F20(IO_L19P_5) F23(IO_L24N_CC_LC_5) F24(IO_L24P_CC_LC_5) F26(IO_L29P_5) G17(IO_L9N_CC_LC_5) G18(IO_L9P_CC_LC_5) G19(IO_L17P_5) G20(IO_L22N_5) G21(IO_L23N_VRP_5) G22(IO_L23P_VRN_5) G23(IO_L28N_VREF_5) G24(IO_L28P_5) G25(IO_L31N_5) G26(IO_L31P_5) H20(IO_L22P_5) H21(IO_L26N_5) H22(IO_L26P_5) H23(IO_L30N_5) H24(IO_L30P_5)

### Notes on the sheet
- Title:
- Engineer:
- Date:
- Revision:
- Sheet
- of
- File:

### Library data of the parts
C34 C35 C37 C39-C41 C43-C45 C47 C48 = POLCAP2: Standard Capacitor
DSP8-DSP11 = SATA-23
U10 = XC4VLX25-10FF668C: Xilinx Virtex-4

## Sheet DSPCONN.4-7.SCHDOC: Backplane
size B; Engineer: Eric Jonas; Organization: Wilson Lab; Address1: Picower Institute, MIT; Address2: 43 Vassar St. 46-5227; Address3: Cambridge, MA 02139; Address4: Australia 2086
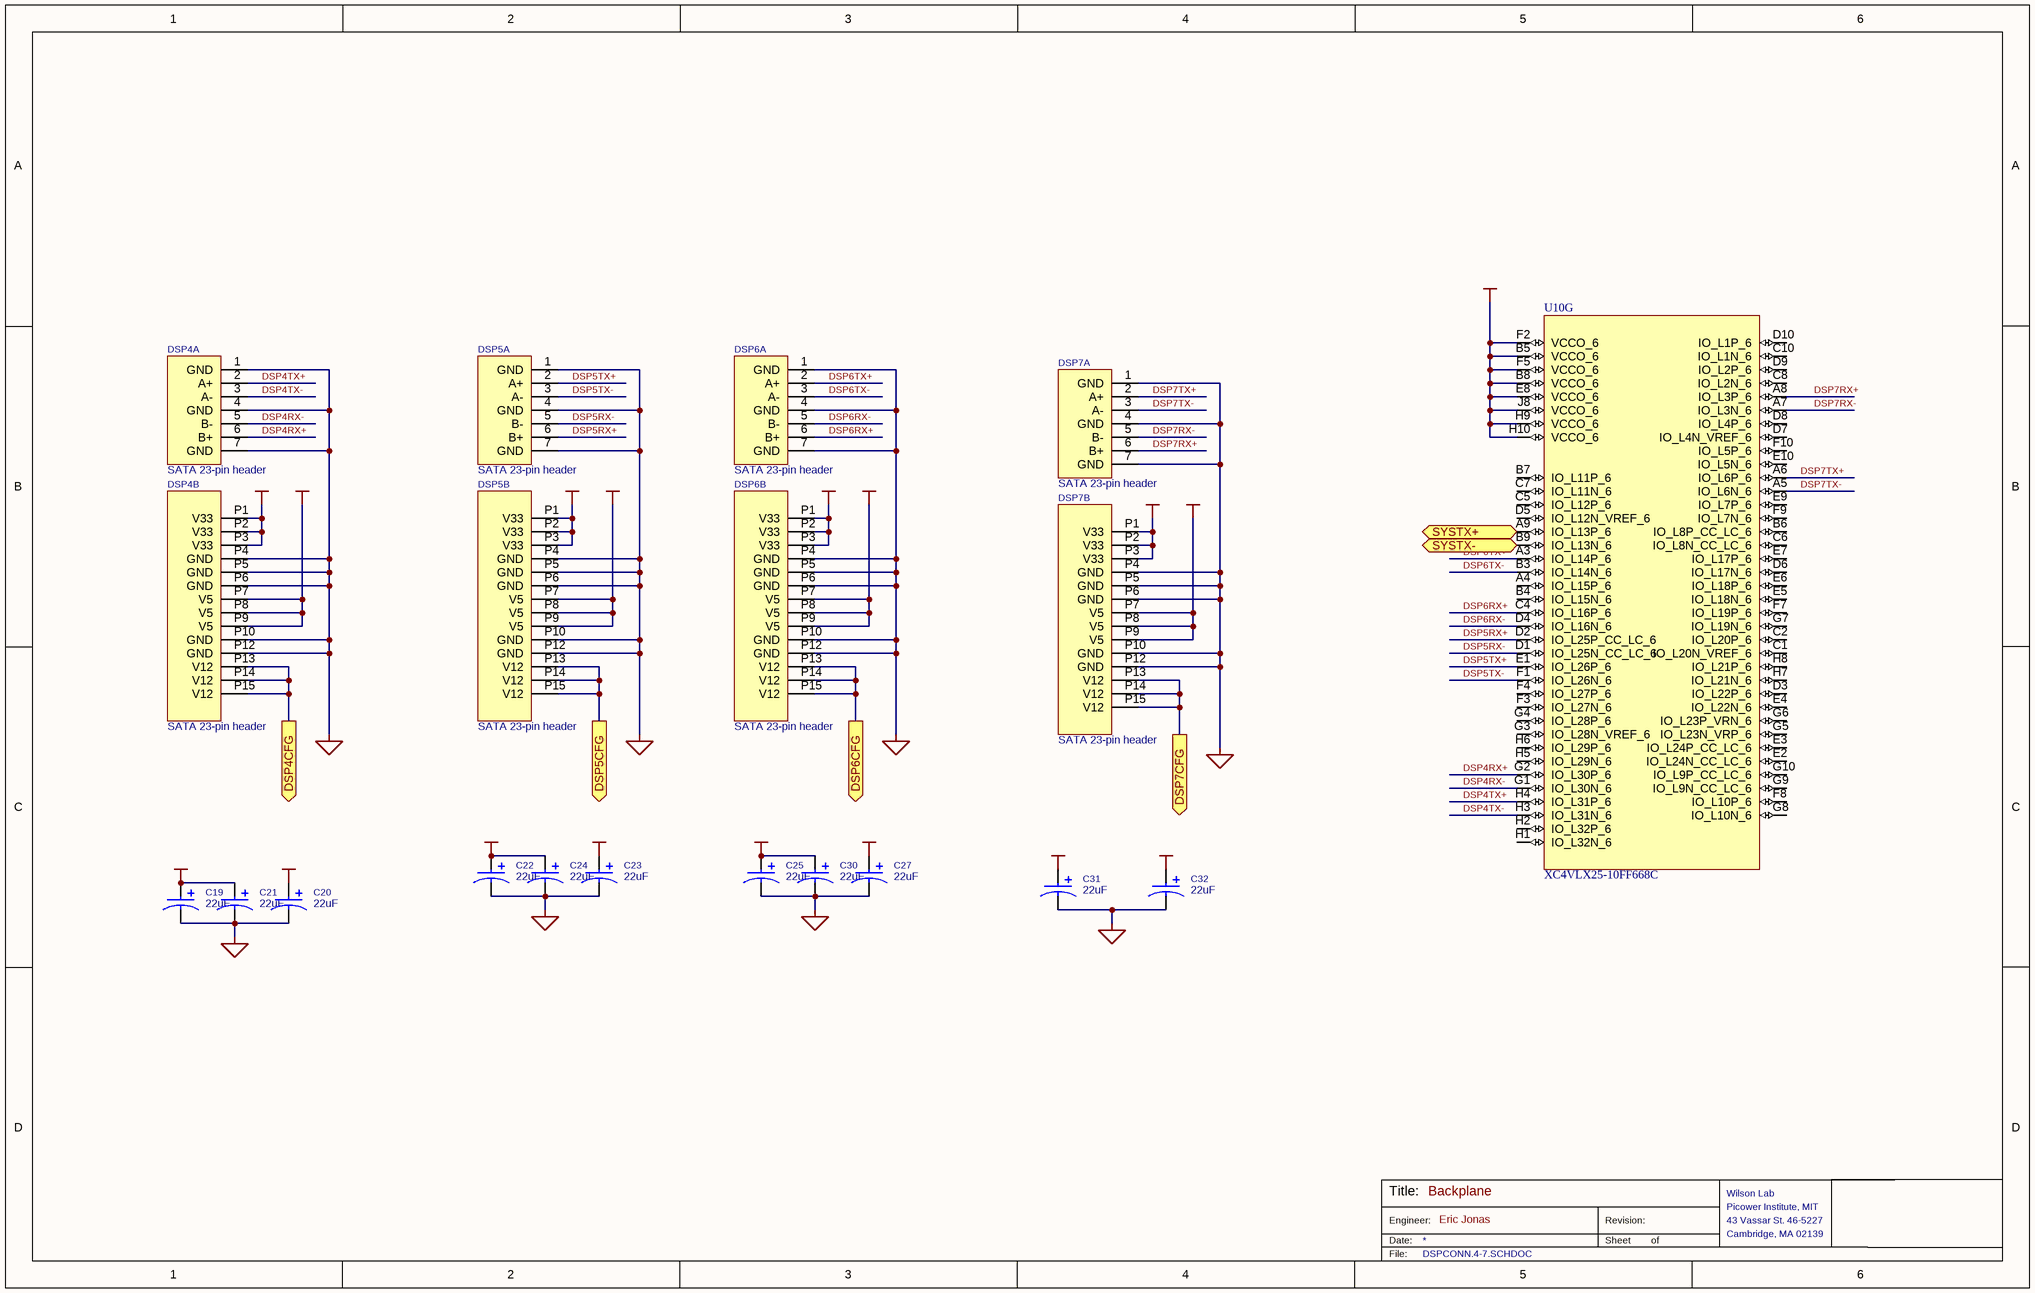
[diagram p5: DSPCONN.4-7.SCHDOC]

### Parts
C19  value 22uF  [6032]  (hidden comment: POLCAP2)
C20  value 22uF  [6032]  (hidden comment: POLCAP2)
C21  value 22uF  [6032]  (hidden comment: POLCAP2)
C22  value 22uF  [6032]  (hidden comment: POLCAP2)
C23  value 22uF  [6032]  (hidden comment: POLCAP2)
C24  value 22uF  [6032]  (hidden comment: POLCAP2)
C25  value 22uF  [6032]  (hidden comment: POLCAP2)
C27  value 22uF  [6032]  (hidden comment: POLCAP2)
C30  value 22uF  [6032]  (hidden comment: POLCAP2)
C31  value 22uF  [6032]  (hidden comment: POLCAP2)
C32  value 22uF  [6032]  (hidden comment: POLCAP2)
DSP4  SATA 23-pin header  [MOLEX 87713-1001]  (parts A,B of 2)
DSP5  SATA 23-pin header  [MOLEX 87713-1001]  (parts A,B of 2)
DSP6  SATA 23-pin header  [MOLEX 87713-1001]  (parts A,B of 2)
DSP7  SATA 23-pin header  [MOLEX 87713-1001]  (parts A,B of 2)
U10  XC4VLX25-10FF668C  [Xilinx FF668]  (part G of 13)

### Ports
DSP4CFG (out), DSP5CFG (out), DSP6CFG (out), DSP7CFG (out), SYSTX+ (in), SYSTX- (in)

### Nets
+2.5VCC: U10.B5(VCCO_6) U10.B8(VCCO_6) U10.E8(VCCO_6) U10.F2(VCCO_6) U10.F5(VCCO_6) U10.H9(VCCO_6) U10.H10(VCCO_6) U10.J8(VCCO_6)
+5VCC: C20.1 C23.1 C27.1 C32.1 DSP4.P7(V5) DSP4.P8(V5) DSP4.P9(V5) DSP5.P7(V5) DSP5.P8(V5) DSP5.P9(V5) DSP6.P7(V5) DSP6.P8(V5) DSP6.P9(V5) DSP7.P7(V5) DSP7.P8(V5) DSP7.P9(V5)
GND: C19.2 C20.2 C21.2 C22.2 C23.2 C24.2 C25.2 C27.2 C30.2 C31.2 C32.2 DSP4.1(GND) DSP4.4(GND) DSP4.7(GND) DSP4.P4(GND) DSP4.P5(GND) DSP4.P6(GND) DSP4.P10(GND) DSP4.P12(GND) DSP5.1(GND) DSP5.4(GND) DSP5.7(GND) DSP5.P4(GND) DSP5.P5(GND) DSP5.P6(GND) DSP5.P10(GND) DSP5.P12(GND) DSP6.1(GND) DSP6.4(GND) DSP6.7(GND) DSP6.P4(GND) DSP6.P5(GND) DSP6.P6(GND) DSP6.P10(GND) DSP6.P12(GND) DSP7.1(GND) DSP7.4(GND) DSP7.7(GND) DSP7.P4(GND) DSP7.P5(GND) DSP7.P6(GND) DSP7.P10(GND) DSP7.P12(GND)
VCC: C19.1 C21.1 C22.1 C24.1 C25.1 C30.1 C31.1 DSP4.P1(V33) DSP4.P2(V33) DSP4.P3(V33) DSP5.P1(V33) DSP5.P2(V33) DSP5.P3(V33) DSP6.P1(V33) DSP6.P2(V33) DSP6.P3(V33) DSP7.P1(V33) DSP7.P2(V33) DSP7.P3(V33)
DSP4RX+: DSP4.6(B+) U10.G2(IO_L30P_6)
DSP4RX-: DSP4.5(B-) U10.G1(IO_L30N_6)
DSP4TX+: DSP4.2(A+) U10.H4(IO_L31P_6)
DSP4TX-: DSP4.3(A-) U10.H3(IO_L31N_6)
DSP5RX+: DSP5.6(B+) U10.D2(IO_L25P_CC_LC_6)
DSP5RX-: DSP5.5(B-) U10.D1(IO_L25N_CC_LC_6)
DSP5TX+: DSP5.2(A+) U10.E1(IO_L26P_6)
DSP5TX-: DSP5.3(A-) U10.F1(IO_L26N_6)
DSP6RX+: DSP6.6(B+) U10.C4(IO_L16P_6)
DSP6RX-: DSP6.5(B-) U10.D4(IO_L16N_6)
DSP6TX+: DSP6.2(A+) U10.A3(IO_L14P_6)
DSP6TX-: DSP6.3(A-) U10.B3(IO_L14N_6)
DSP7RX+: DSP7.6(B+) U10.A8(IO_L3P_6)
DSP7RX-: DSP7.5(B-) U10.A7(IO_L3N_6)
DSP7TX+: DSP7.2(A+) U10.A6(IO_L6P_6)
DSP7TX-: DSP7.3(A-) U10.A5(IO_L6N_6)
SYSTX+: U10.A9(IO_L13P_6) ; port SYSTX+
SYSTX-: U10.B9(IO_L13N_6) ; port SYSTX-
NetDSP4_P13: DSP4.P13(V12) DSP4.P14(V12) DSP4.P15(V12) ; port DSP4CFG
NetDSP5_P13: DSP5.P13(V12) DSP5.P14(V12) DSP5.P15(V12) ; port DSP5CFG
NetDSP6_P13: DSP6.P13(V12) DSP6.P14(V12) DSP6.P15(V12) ; port DSP6CFG
NetDSP7_P13: DSP7.P13(V12) DSP7.P14(V12) DSP7.P15(V12) ; port DSP7CFG

Not connected (* = marked no-connect by the designer): U10 A4(IO_L15P_6) B4(IO_L15N_6) B6(IO_L8P_CC_LC_6) B7(IO_L11P_6) C1(IO_L20N_VREF_6) C2(IO_L20P_6) C5(IO_L12P_6) C6(IO_L8N_CC_LC_6) C7(IO_L11N_6) C8(IO_L2N_6) C10(IO_L1N_6) D3(IO_L22P_6) D5(IO_L12N_VREF_6) D6(IO_L17N_6) D7(IO_L4N_VREF_6) D8(IO_L4P_6) D9(IO_L2P_6) D10(IO_L1P_6) E2(IO_L24N_CC_LC_6) E3(IO_L24P_CC_LC_6) E4(IO_L22N_6) E5(IO_L18N_6) E6(IO_L18P_6) E7(IO_L17P_6) E9(IO_L7P_6) E10(IO_L5N_6) F3(IO_L27N_6) F4(IO_L27P_6) F7(IO_L19P_6) F8(IO_L10P_6) F9(IO_L7N_6) F10(IO_L5P_6) G3(IO_L28N_VREF_6) G4(IO_L28P_6) G5(IO_L23N_VRP_6) G6(IO_L23P_VRN_6) G7(IO_L19N_6) G8(IO_L10N_6) G9(IO_L9N_CC_LC_6) G10(IO_L9P_CC_LC_6) H1(IO_L32N_6) H2(IO_L32P_6) H5(IO_L29N_6) H6(IO_L29P_6) H7(IO_L21N_6) H8(IO_L21P_6)

### Notes on the sheet
- Title:
- Engineer:
- Date:
- Revision:
- Sheet
- of
- File:

### Library data of the parts
C19-C25 C27 C30-C32 = POLCAP2: Standard Capacitor
DSP4-DSP7 = SATA-23
U10 = XC4VLX25-10FF668C: Xilinx Virtex-4

## Sheet DSPCONN.0-3.SCHDOC: Backplane
size B; Engineer: Eric Jonas; Organization: Wilson Lab; Address1: Picower Institute, MIT; Address2: 43 Vassar St. 46-5227; Address3: Cambridge, MA 02139; Address4: Australia 2086
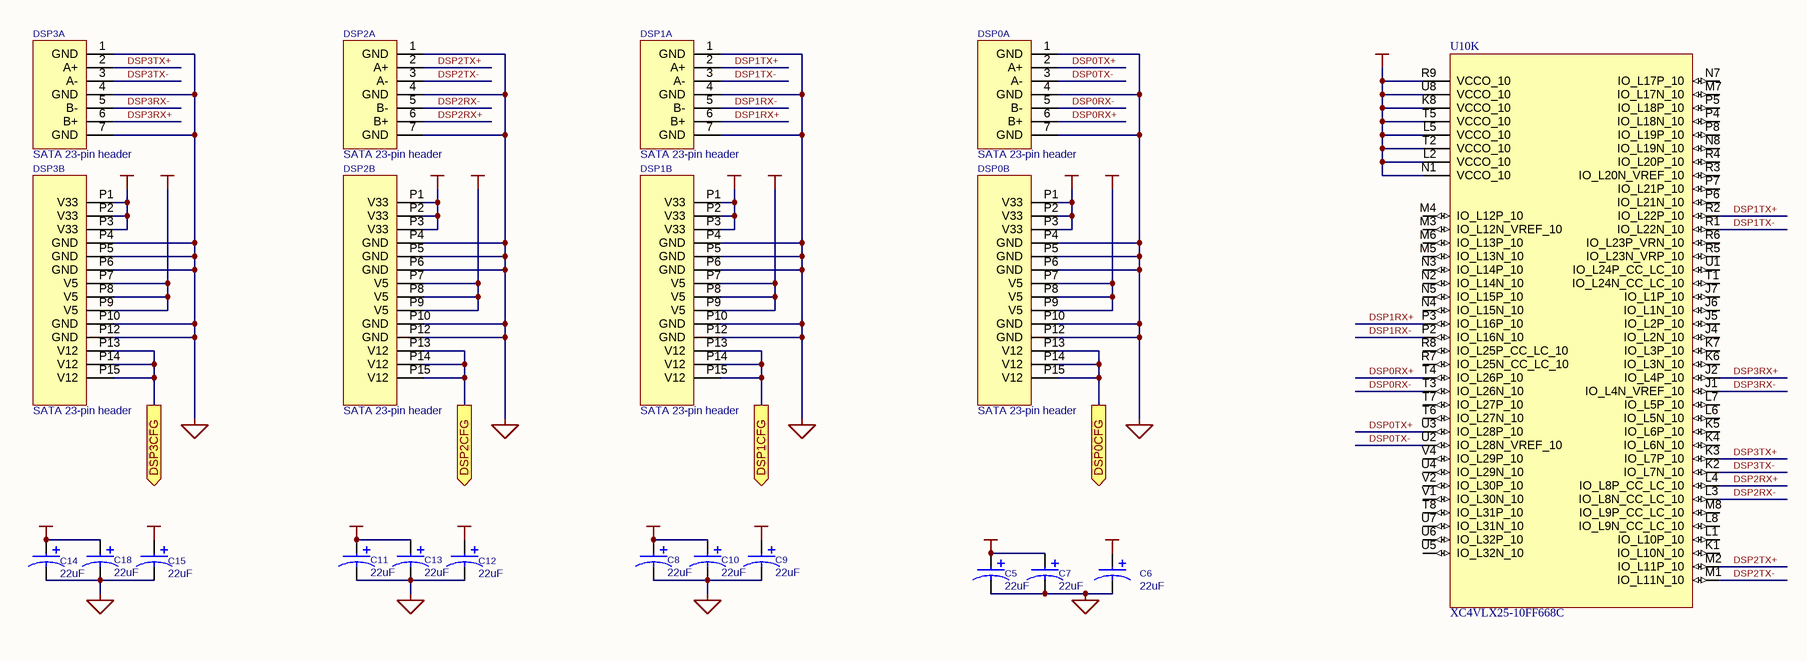
[diagram p6: DSPCONN.0-3.SCHDOC]

### Parts
C5  value 22uF  [6032]
C6  value 22uF  [6032]
C7  value 22uF  [6032]
C8  value 22uF  [6032]
C9  value 22uF  [6032]
C10  value 22uF  [6032]
C11  value 22uF  [6032]
C12  value 22uF  [6032]
C13  value 22uF  [6032]
C14  value 22uF  [6032]
C15  value 22uF  [6032]
C18  value 22uF  [6032]
DSP0  SATA 23-pin header  [MOLEX 87713-1001]  (parts A,B of 2)
DSP1  SATA 23-pin header  [MOLEX 87713-1001]  (parts A,B of 2)
DSP2  SATA 23-pin header  [MOLEX 87713-1001]  (parts A,B of 2)
DSP3  SATA 23-pin header  [MOLEX 87713-1001]  (parts A,B of 2)
U10  XC4VLX25-10FF668C  [Xilinx FF668]  (part K of 13)

### Ports
DSP0CFG (out), DSP1CFG (out), DSP2CFG (out), DSP3CFG (out)

### Nets
+2.5VCC: U10.K8(VCCO_10) U10.L2(VCCO_10) U10.L5(VCCO_10) U10.N1(VCCO_10) U10.R9(VCCO_10) U10.T2(VCCO_10) U10.T5(VCCO_10) U10.U8(VCCO_10)
+5VCC: C6.1 C9.1 C12.1 C15.1 DSP0.P7(V5) DSP0.P8(V5) DSP0.P9(V5) DSP1.P7(V5) DSP1.P8(V5) DSP1.P9(V5) DSP2.P7(V5) DSP2.P8(V5) DSP2.P9(V5) DSP3.P7(V5) DSP3.P8(V5) DSP3.P9(V5)
GND: C5.2 C6.2 C7.2 C8.2 C9.2 C10.2 C11.2 C12.2 C13.2 C14.2 C15.2 C18.2 DSP0.1(GND) DSP0.4(GND) DSP0.7(GND) DSP0.P4(GND) DSP0.P5(GND) DSP0.P6(GND) DSP0.P10(GND) DSP0.P12(GND) DSP1.1(GND) DSP1.4(GND) DSP1.7(GND) DSP1.P4(GND) DSP1.P5(GND) DSP1.P6(GND) DSP1.P10(GND) DSP1.P12(GND) DSP2.1(GND) DSP2.4(GND) DSP2.7(GND) DSP2.P4(GND) DSP2.P5(GND) DSP2.P6(GND) DSP2.P10(GND) DSP2.P12(GND) DSP3.1(GND) DSP3.4(GND) DSP3.7(GND) DSP3.P4(GND) DSP3.P5(GND) DSP3.P6(GND) DSP3.P10(GND) DSP3.P12(GND)
VCC: C5.1 C7.1 C8.1 C10.1 C11.1 C13.1 C14.1 C18.1 DSP0.P1(V33) DSP0.P2(V33) DSP0.P3(V33) DSP1.P1(V33) DSP1.P2(V33) DSP1.P3(V33) DSP2.P1(V33) DSP2.P2(V33) DSP2.P3(V33) DSP3.P1(V33) DSP3.P2(V33) DSP3.P3(V33)
DSP0RX+: DSP0.6(B+) U10.T4(IO_L26P_10)
DSP0RX-: DSP0.5(B-) U10.T3(IO_L26N_10)
DSP0TX+: DSP0.2(A+) U10.U3(IO_L28P_10)
DSP0TX-: DSP0.3(A-) U10.U2(IO_L28N_VREF_10)
DSP1RX+: DSP1.6(B+) U10.P3(IO_L16P_10)
DSP1RX-: DSP1.5(B-) U10.P2(IO_L16N_10)
DSP1TX+: DSP1.2(A+) U10.R2(IO_L22P_10)
DSP1TX-: DSP1.3(A-) U10.R1(IO_L22N_10)
DSP2RX+: DSP2.6(B+) U10.L4(IO_L8P_CC_LC_10)
DSP2RX-: DSP2.5(B-) U10.L3(IO_L8N_CC_LC_10)
DSP2TX+: DSP2.2(A+) U10.M2(IO_L11P_10)
DSP2TX-: DSP2.3(A-) U10.M1(IO_L11N_10)
DSP3RX+: DSP3.6(B+) U10.J2(IO_L4P_10)
DSP3RX-: DSP3.5(B-) U10.J1(IO_L4N_VREF_10)
DSP3TX+: DSP3.2(A+) U10.K3(IO_L7P_10)
DSP3TX-: DSP3.3(A-) U10.K2(IO_L7N_10)
NetDSP0_P13: DSP0.P13(V12) DSP0.P14(V12) DSP0.P15(V12) ; port DSP0CFG
NetDSP1_P13: DSP1.P13(V12) DSP1.P14(V12) DSP1.P15(V12) ; port DSP1CFG
NetDSP2_P13: DSP2.P13(V12) DSP2.P14(V12) DSP2.P15(V12) ; port DSP2CFG
NetDSP3_P13: DSP3.P13(V12) DSP3.P14(V12) DSP3.P15(V12) ; port DSP3CFG

Not connected (* = marked no-connect by the designer): U10 J4(IO_L2N_10) J5(IO_L2P_10) J6(IO_L1N_10) J7(IO_L1P_10) K1(IO_L10N_10) K4(IO_L6N_10) K5(IO_L6P_10) K6(IO_L3N_10) K7(IO_L3P_10) L1(IO_L10P_10) L6(IO_L5N_10) L7(IO_L5P_10) L8(IO_L9N_CC_LC_10) M3(IO_L12N_VREF_10) M4(IO_L12P_10) M5(IO_L13N_10) M6(IO_L13P_10) M7(IO_L17N_10) M8(IO_L9P_CC_LC_10) N2(IO_L14N_10) N3(IO_L14P_10) N4(IO_L15N_10) N5(IO_L15P_10) N7(IO_L17P_10) N8(IO_L19N_10) P4(IO_L18N_10) P5(IO_L18P_10) P6(IO_L21N_10) P7(IO_L21P_10) P8(IO_L19P_10) R3(IO_L20N_VREF_10) R4(IO_L20P_10) R5(IO_L23N_VRP_10) R6(IO_L23P_VRN_10) R7(IO_L25N_CC_LC_10) R8(IO_L25P_CC_LC_10) T1(IO_L24N_CC_LC_10) T6(IO_L27N_10) T7(IO_L27P_10) T8(IO_L31P_10) U1(IO_L24P_CC_LC_10) U4(IO_L29N_10) U5(IO_L32N_10) U6(IO_L32P_10) U7(IO_L31N_10) V1(IO_L30N_10) V2(IO_L30P_10) V4(IO_L29P_10)

### Notes on the sheet
- Title:
- Engineer:
- Date:
- Revision:
- Sheet
- of
- File:

### Library data of the parts
C5-C15 C18 = POLCAP2: Standard Capacitor
DSP0-DSP3 = SATA-23
U10 = XC4VLX25-10FF668C: Xilinx Virtex-4

## Sheet fpga.SCHDOC: Backplane
size B; Engineer: Eric Jonas; Organization: Wilson Lab; Address1: Picower Institute, MIT; Address2: 43 Vassar St. 46-5227; Address3: Cambridge, MA 02139; Address4: Australia 2086
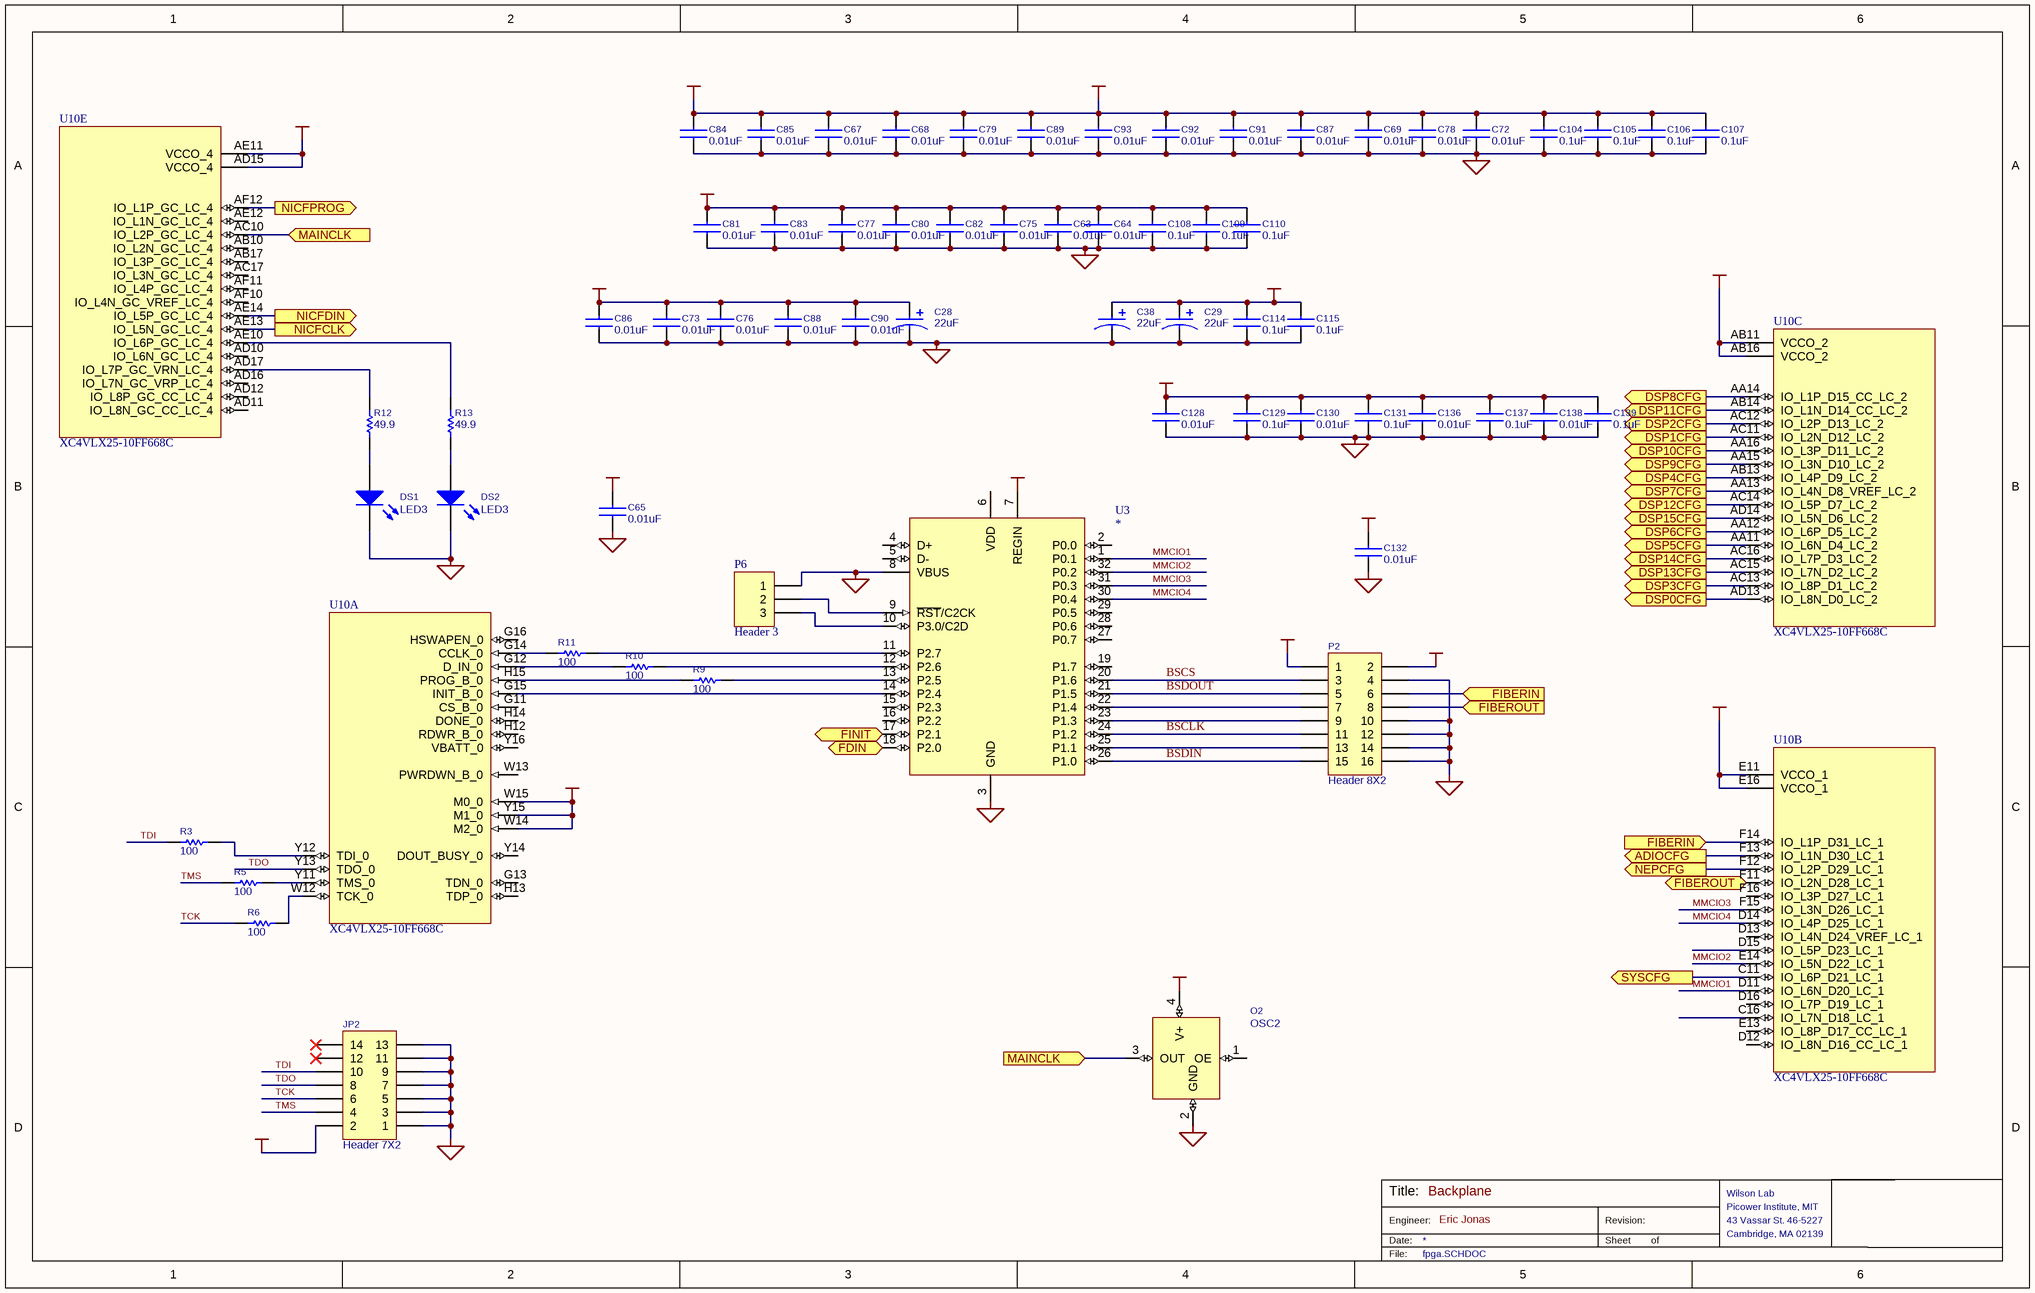
[diagram p7: fpga.SCHDOC]

### Parts
C28  value 22uF  [6032]  (hidden comment: POLCAP2)
C29  value 22uF  [6032]  (hidden comment: POLCAP2)
C38  value 22uF  [6032]  (hidden comment: POLCAP2)
C63  value 0.01uF  [0402]  (hidden comment: CAPACITOR)
C64  value 0.01uF  [0402]  (hidden comment: CAPACITOR)
C65  value 0.01uF  [0402]  (hidden comment: CAPACITOR)
C67  value 0.01uF  [0402]  (hidden comment: CAPACITOR)
C68  value 0.01uF  [0402]  (hidden comment: CAPACITOR)
C69  value 0.01uF  [0402]  (hidden comment: CAPACITOR)
C72  value 0.01uF  [0402]  (hidden comment: CAPACITOR)
C73  value 0.01uF  [0402]  (hidden comment: CAPACITOR)
C75  value 0.01uF  [0402]  (hidden comment: CAPACITOR)
C76  value 0.01uF  [0402]  (hidden comment: CAPACITOR)
C77  value 0.01uF  [0402]  (hidden comment: CAPACITOR)
C78  value 0.01uF  [0402]  (hidden comment: CAPACITOR)
C79  value 0.01uF  [0402]  (hidden comment: CAPACITOR)
C80  value 0.01uF  [0402]  (hidden comment: CAPACITOR)
C81  value 0.01uF  [0402]  (hidden comment: CAPACITOR)
C82  value 0.01uF  [0402]  (hidden comment: CAPACITOR)
C83  value 0.01uF  [0402]  (hidden comment: CAPACITOR)
C84  value 0.01uF  [0402]  (hidden comment: CAPACITOR)
C85  value 0.01uF  [0402]  (hidden comment: CAPACITOR)
C86  value 0.01uF  [0402]  (hidden comment: CAPACITOR)
C87  value 0.01uF  [0402]  (hidden comment: CAPACITOR)
C88  value 0.01uF  [0402]  (hidden comment: CAPACITOR)
C89  value 0.01uF  [0402]  (hidden comment: CAPACITOR)
C90  value 0.01uF  [0402]  (hidden comment: CAPACITOR)
C91  value 0.01uF  [0402]  (hidden comment: CAPACITOR)
C92  value 0.01uF  [0402]  (hidden comment: CAPACITOR)
C93  value 0.01uF  [0402]  (hidden comment: CAPACITOR)
C104  value 0.1uF  [0603]  (hidden comment: CAPACITOR)
C105  value 0.1uF  [0603]  (hidden comment: CAPACITOR)
C106  value 0.1uF  [0603]  (hidden comment: CAPACITOR)
C107  value 0.1uF  [0603]  (hidden comment: CAPACITOR)
C108  value 0.1uF  [0603]  (hidden comment: CAPACITOR)
C109  value 0.1uF  [0603]  (hidden comment: CAPACITOR)
C110  value 0.1uF  [0603]  (hidden comment: CAPACITOR)
C114  value 0.1uF  [0603]  (hidden comment: CAPACITOR)
C115  value 0.1uF  [0603]  (hidden comment: CAPACITOR)
C128  value 0.01uF  [0402]  (hidden comment: CAPACITOR)
C129  value 0.1uF  [0603]  (hidden comment: CAPACITOR)
C130  value 0.01uF  [0402]  (hidden comment: CAPACITOR)
C131  value 0.1uF  [0603]  (hidden comment: CAPACITOR)
C132  value 0.01uF  [0402]  (hidden comment: CAPACITOR)
C136  value 0.01uF  [0402]  (hidden comment: CAPACITOR)
C137  value 0.1uF  [0603]  (hidden comment: CAPACITOR)
C138  value 0.01uF  [0402]  (hidden comment: CAPACITOR)
C139  value 0.1uF  [0603]  (hidden comment: CAPACITOR)
DS1  LED3  [SMD _LED]
DS2  LED3  [SMD _LED]
JP2  Header 7X2  [SMT 2x7 2mm HDR]
O2  OSC2  [ECS-3953M]
P2  Header 8X2  [MOLEX 15-91-2160]
P6  Header 3  [HDR1X3]
R3  value 100  [0603]  (hidden comment: current-limiting series res)
R5  value 100  [0603]  (hidden comment: current-limiting series res)
R6  value 100  [0603]  (hidden comment: current-limiting series res)
R9  value 100  [0603]  (hidden comment: RESISTOR)
R10  value 100  [0603]  (hidden comment: RESISTOR)
R11  value 100  [0603]  (hidden comment: RESISTOR)
R12  value 49.9  [0402]  (hidden comment: current-limiting series res)
R13  value 49.9  [0402]  (hidden comment: current-limiting series res)
U3  *  [QFP7x7-G32/N]
U10  XC4VLX25-10FF668C  [Xilinx FF668]  (parts A,B,C,E of 13)

### Ports
ADIOCFG (out), DSP0CFG (out), DSP1CFG (out), DSP2CFG (out), DSP3CFG (out), DSP4CFG (out), DSP5CFG (out), DSP6CFG (out), DSP7CFG (out), DSP8CFG (out), DSP9CFG (out), DSP10CFG (out), DSP11CFG (out), DSP12CFG (out), DSP13CFG (out), DSP14CFG (out), DSP15CFG (out), FDIN (out), FIBERIN (in), FIBEROUT (in), FINIT (bidir), MAINCLK (in), NEPCFG (out), NICFCLK (out), NICFDIN (out), NICFPROG (out), SYSCFG (out)

### Nets
+0.9VCC: C132.1
+1.2VCC: C28.1 C73.1 C76.1 C86.1 C88.1 C90.1
+1.8VCC: C128.1 C129.1 C130.1 C131.1 C136.1 C137.1 C138.1 C139.1
+2.5VCC: C29.1 C38.1 C67.1 C68.1 C69.1 C72.1 C78.1 C79.1 C84.1 C85.1 C87.1 C89.1 C91.1 C92.1 C93.1 C104.1 C105.1 C106.1 C107.1 C114.1 C115.1
+5VCC: C65.1 P2.2 U3.7(REGIN)
GND: C28.2 C29.2 C38.2 C63.2 C64.2 C65.2 C67.2 C68.2 C69.2 C72.2 C73.2 C75.2 C76.2 C77.2 C78.2 C79.2 C80.2 C81.2 C82.2 C83.2 C84.2 C85.2 C86.2 C87.2 C88.2 C89.2 C90.2 C91.2 C92.2 C93.2 C104.2 C105.2 C106.2 C107.2 C108.2 C109.2 C110.2 C114.2 C115.2 C128.2 C129.2 C130.2 C131.2 C132.2 C136.2 C137.2 C138.2 C139.2 DS1.2(K) DS2.2(K) JP2.1 JP2.3 JP2.5 JP2.7 JP2.9 JP2.11 JP2.13 O2.2(GND) P2.4 P2.10 P2.12 P2.14 P2.16 P6.1 U3.3(GND) U3.8(VBUS)
VCC: C63.1 C64.1 C75.1 C77.1 C80.1 C81.1 C82.1 C83.1 C108.1 C109.1 C110.1 JP2.2 O2.4(V+) P2.1 U10.AB11(VCCO_2) U10.AB16(VCCO_2) U10.AD15(VCCO_4) U10.AE11(VCCO_4) U10.E11(VCCO_1) U10.E16(VCCO_1) U10.W14(M2_0) U10.W15(M0_0) U10.Y15(M1_0)
BSCLK: P2.11 U3.24(P1.2)
BSCS: P2.3 U3.20(P1.6)
BSDIN: P2.15 U3.26(P1.0)
BSDOUT: P2.5 U3.21(P1.5)
MMCIO1: U3.1(P0.1) U10.D11(IO_L6N_D20_LC_1)
MMCIO2: U3.32(P0.2) U10.E14(IO_L5N_D22_LC_1)
MMCIO3: U3.31(P0.3) U10.F15(IO_L3N_D26_LC_1)
MMCIO4: U3.30(P0.4) U10.D14(IO_L4P_D25_LC_1)
TCK: JP2.6 R6.1
TDI: JP2.10 R3.2
TDO: JP2.8 U10.Y13(TDO_0)
TMS: JP2.4 R5.2
NetCONN1_54: U10.AF12(IO_L1P_GC_LC_4) ; port NICFPROG
NetCONN1_55: U10.AE14(IO_L5P_GC_LC_4) ; port NICFDIN
NetCONN1_56: U10.AE13(IO_L5N_GC_LC_4) ; port NICFCLK
NetDS1_1: DS1.1(A) R12.2
NetDS2_1: DS2.1(A) R13.2
NetDSP0_P13: U10.AD13(IO_L8N_D0_LC_2) ; port DSP0CFG
NetDSP1_P13: U10.AC11(IO_L2N_D12_LC_2) ; port DSP1CFG
NetDSP2_P13: U10.AC12(IO_L2P_D13_LC_2) ; port DSP2CFG
NetDSP3_P13: U10.AC13(IO_L8P_D1_LC_2) ; port DSP3CFG
NetDSP4_P13: U10.AB13(IO_L4P_D9_LC_2) ; port DSP4CFG
NetDSP5_P13: U10.AA11(IO_L6N_D4_LC_2) ; port DSP5CFG
NetDSP6_P13: U10.AA12(IO_L6P_D5_LC_2) ; port DSP6CFG
NetDSP7_P13: U10.AA13(IO_L4N_D8_VREF_LC_2) ; port DSP7CFG
NetDSP8_P13: U10.AA14(IO_L1P_D15_CC_LC_2) ; port DSP8CFG
NetDSP9_P13: U10.AA15(IO_L3N_D10_LC_2) ; port DSP9CFG
NetDSP10_P13: U10.AA16(IO_L3P_D11_LC_2) ; port DSP10CFG
NetDSP11_P13: U10.AB14(IO_L1N_D14_CC_LC_2) ; port DSP11CFG
NetDSP12_P13: U10.AC14(IO_L5P_D7_LC_2) ; port DSP12CFG
NetDSP13_P13: U10.AC15(IO_L7N_D2_LC_2) ; port DSP13CFG
NetDSP14_P13: U10.AC16(IO_L7P_D3_LC_2) ; port DSP14CFG
NetDSP15_P13: U10.AD14(IO_L5N_D6_LC_2) ; port DSP15CFG
NetO2_3: O2.3(OUT) U10.AC10(IO_L2P_GC_LC_4) ; port MAINCLK
NetP2_6: P2.6 U10.F14(IO_L1P_D31_LC_1) ; port FIBERIN
NetP2_7: P2.7 U3.22(P1.4)
NetP2_8: P2.8 U10.F11(IO_L2N_D28_LC_1) ; port FIBEROUT
NetP2_9: P2.9 U3.23(P1.3)
NetP2_13: P2.13 U3.25(P1.1)
NetP3_7: U10.C11(IO_L6P_D21_LC_1) ; port SYSCFG
NetP4_7: U10.F12(IO_L2P_D29_LC_1) ; port NEPCFG
NetP5_7: U10.F13(IO_L1N_D30_LC_1) ; port ADIOCFG
NetP6_2: P6.2 U3.9(~{RST}/C2CK)
NetP6_3: P6.3 U3.10(P3.0/C2D)
NetR3_1: R3.1 U10.Y12(TDI_0)
NetR5_1: R5.1 U10.Y11(TMS_0)
NetR6_2: R6.2 U10.W12(TCK_0)
NetR9_1: R9.1 U3.13(P2.5)
NetR9_2: R9.2 U10.H15(PROG_B_0)
NetR10_1: R10.1 U3.12(P2.6)
NetR10_2: R10.2 U10.G12(D_IN_0)
NetR11_1: R11.1 U3.11(P2.7)
NetR11_2: R11.2 U10.G14(CCLK_0)
NetR12_1: R12.1 U10.AD17(IO_L7P_GC_VRN_LC_4)
NetR13_1: R13.1 U10.AE10(IO_L6P_GC_LC_4)
NetU3_14: U3.14(P2.4) U10.G15(INIT_B_0)
NetU3_17: U3.17(P2.1) ; port FINIT
NetU3_18: U3.18(P2.0) ; port FDIN

Not connected (* = marked no-connect by the designer): JP2 12* 14*; O2 1(OE); U3 2(P0.0) 4(D+) 5(D-) 6(VDD) 15(P2.3) 16(P2.2) 19(P1.7) 27(P0.7) 28(P0.6) 29(P0.5); U10 AB10(IO_L2N_GC_LC_4) AB17(IO_L3P_GC_LC_4) AC17(IO_L3N_GC_LC_4) AD10(IO_L6N_GC_LC_4) AD11(IO_L8N_GC_CC_LC_4) AD12(IO_L8P_GC_CC_LC_4) AD16(IO_L7N_GC_VRP_LC_4) AE12(IO_L1N_GC_LC_4) AF10(IO_L4N_GC_VREF_LC_4) AF11(IO_L4P_GC_LC_4) C16(IO_L7N_D18_LC_1) D12(IO_L8N_D16_CC_LC_1) D13(IO_L4N_D24_VREF_LC_1) D15(IO_L5P_D23_LC_1) D16(IO_L7P_D19_LC_1) E13(IO_L8P_D17_CC_LC_1) F16(IO_L3P_D27_LC_1) G11(CS_B_0) G13(TDN_0) G16(HSWAPEN_0) H12(RDWR_B_0) H13(TDP_0) H14(DONE_0) W13(PWRDWN_B_0) Y14(DOUT_BUSY_0) Y16(VBATT_0)

### Notes on the sheet
- Labels drawn without touching a wire or pin: VCC
- Title:
- Engineer:
- Date:
- Revision:
- Sheet
- of
- File:

### Library data of the parts
C28 C29 C38 = POLCAP2: Standard Capacitor
C63-C65 C67-C69 C72 C73 C75-C93 C104-C110 C114 C115 C128-C132 C136-C139 = CAPACITOR: Standard Capacitor
DS1 DS2 = LED3: Typical BLUE SiC LED; Published: 8-Jun-2000; LatestRevisionDate: 17-Dec-2003; LatestRevisionNote: PCB Footprint replaced.; Publisher: Altium Limited
JP2 = Header 7X2: Header, 7-Pin, Dual row; Manufacturer: Generic Components; Class I: Connector; Revision: July-2002: Re-released for DXP Platform.; Publisher: Altium Limited
O2 = OSC2: ECS SMD Oscillator, ECS-3953M; Part: SG-636PCE 30.0000MC0
P2 = Header 8X2: Header, 8-Pin, Dual row; LatestRevisionDate: 17-Jul-2002; LatestRevisionNote: Re-released for DXP Platform.; Publisher: Altium Limited
P6 = Header 3: Header, 3-Pin; LatestRevisionDate: 17-Jul-2002; LatestRevisionNote: Re-released for DXP Platform.; Publisher: Altium Limited
R3 R5 R6 R9-R11 = RESISTOR: Standard Passive Resistor; Tolerance: 1%
R12 R13 = RESISTOR: as R15 on sheet network
U3 = C8051F342/3/6/7: SiLiabs USB Micro
U10 = XC4VLX25-10FF668C: Xilinx Virtex-4

## Nets that join several sheets
+0.9VCC: network (5 pins), power and clocks (C1.1 R17.1 U6.5), fpga (C132.1)
+1.2VCC: power and clocks (33 pins), fpga (6 pins)
+1.8VCC: network (25 pins), power and clocks (C16.2 U1.4), fpga (8 pins)
+2.5VCC: peripheralconn (U10.B11 U10.B16), DSPCONN.12-15 (8 pins), power and clocks (17 pins), DSPCONN.8-11 (8 pins), DSPCONN.4-7 (8 pins), DSPCONN.0-3 (8 pins), fpga (21 pins)
+5VCC: peripheralconn (9 pins), DSPCONN.12-15 (16 pins), power and clocks (C116.1 PM1.6), DSPCONN.8-11 (16 pins), DSPCONN.4-7 (16 pins), DSPCONN.0-3 (16 pins), fpga (C65.1 P2.2 U3.7)
+12VCC: peripheralconn (P3.8 P4.8 P5.8), power and clocks (16 pins)
GND: network (34 pins), peripheralconn (33 pins), DSPCONN.12-15 (44 pins), power and clocks (138 pins), DSPCONN.8-11 (43 pins), DSPCONN.4-7 (43 pins), DSPCONN.0-3 (44 pins), fpga (66 pins)
VCC: network (9 pins), peripheralconn (9 pins), power and clocks (13 pins), DSPCONN.4-7 (19 pins), DSPCONN.0-3 (20 pins), fpga (23 pins)
VCC2: DSPCONN.12-15 (20 pins), power and clocks (C118.1 PM3.6), DSPCONN.8-11 (19 pins)
ADIOTX+: peripheralconn (J3.2), DSPCONN.8-11 (U10.B18)
ADIOTX-: peripheralconn (J3.3), DSPCONN.8-11 (U10.A18)
NEPTX+: peripheralconn (J2.2), DSPCONN.8-11 (U10.C17)
NEPTX-: peripheralconn (J2.3), DSPCONN.8-11 (U10.D17)
NetCONN1_54: network (CONN1.54), fpga (U10.AF12)
NetCONN1_55: network (CONN1.55), fpga (U10.AE14)
NetCONN1_56: network (CONN1.56), fpga (U10.AE13)
NetDSP0_P13: DSPCONN.0-3 (DSP0.P13 DSP0.P14 DSP0.P15), fpga (U10.AD13)
NetDSP1_P13: DSPCONN.0-3 (DSP1.P13 DSP1.P14 DSP1.P15), fpga (U10.AC11)
NetDSP2_P13: DSPCONN.0-3 (DSP2.P13 DSP2.P14 DSP2.P15), fpga (U10.AC12)
NetDSP3_P13: DSPCONN.0-3 (DSP3.P13 DSP3.P14 DSP3.P15), fpga (U10.AC13)
NetDSP4_P13: DSPCONN.4-7 (DSP4.P13 DSP4.P14 DSP4.P15), fpga (U10.AB13)
NetDSP5_P13: DSPCONN.4-7 (DSP5.P13 DSP5.P14 DSP5.P15), fpga (U10.AA11)
NetDSP6_P13: DSPCONN.4-7 (DSP6.P13 DSP6.P14 DSP6.P15), fpga (U10.AA12)
NetDSP7_P13: DSPCONN.4-7 (DSP7.P13 DSP7.P14 DSP7.P15), fpga (U10.AA13)
NetDSP8_P13: DSPCONN.8-11 (DSP8.P13 DSP8.P14 DSP8.P15), fpga (U10.AA14)
NetDSP9_P13: DSPCONN.8-11 (DSP9.P13 DSP9.P14 DSP9.P15), fpga (U10.AA15)
NetDSP10_P13: DSPCONN.8-11 (DSP10.P13 DSP10.P14 DSP10.P15), fpga (U10.AA16)
NetDSP11_P13: DSPCONN.8-11 (DSP11.P13 DSP11.P14 DSP11.P15), fpga (U10.AB14)
NetDSP12_P13: DSPCONN.12-15 (DSP12.P13 DSP12.P14 DSP12.P15), fpga (U10.AC14)
NetDSP13_P13: DSPCONN.12-15 (DSP13.P13 DSP13.P14 DSP13.P15), fpga (U10.AC15)
NetDSP14_P13: DSPCONN.12-15 (DSP14.P13 DSP14.P14 DSP14.P15), fpga (U10.AC16)
NetDSP15_P13: DSPCONN.12-15 (DSP15.P13 DSP15.P14 DSP15.P15), fpga (U10.AD14)
NetP3_7: peripheralconn (P3.7), fpga (U10.C11)
NetP4_7: peripheralconn (P4.7), fpga (U10.F12)
NetP5_7: peripheralconn (P5.7), fpga (U10.F13)
SYSTX+: peripheralconn (J1.2), DSPCONN.4-7 (U10.A9)
SYSTX-: peripheralconn (J1.3), DSPCONN.4-7 (U10.B9)